# Altium project Discharge.PrjPcb
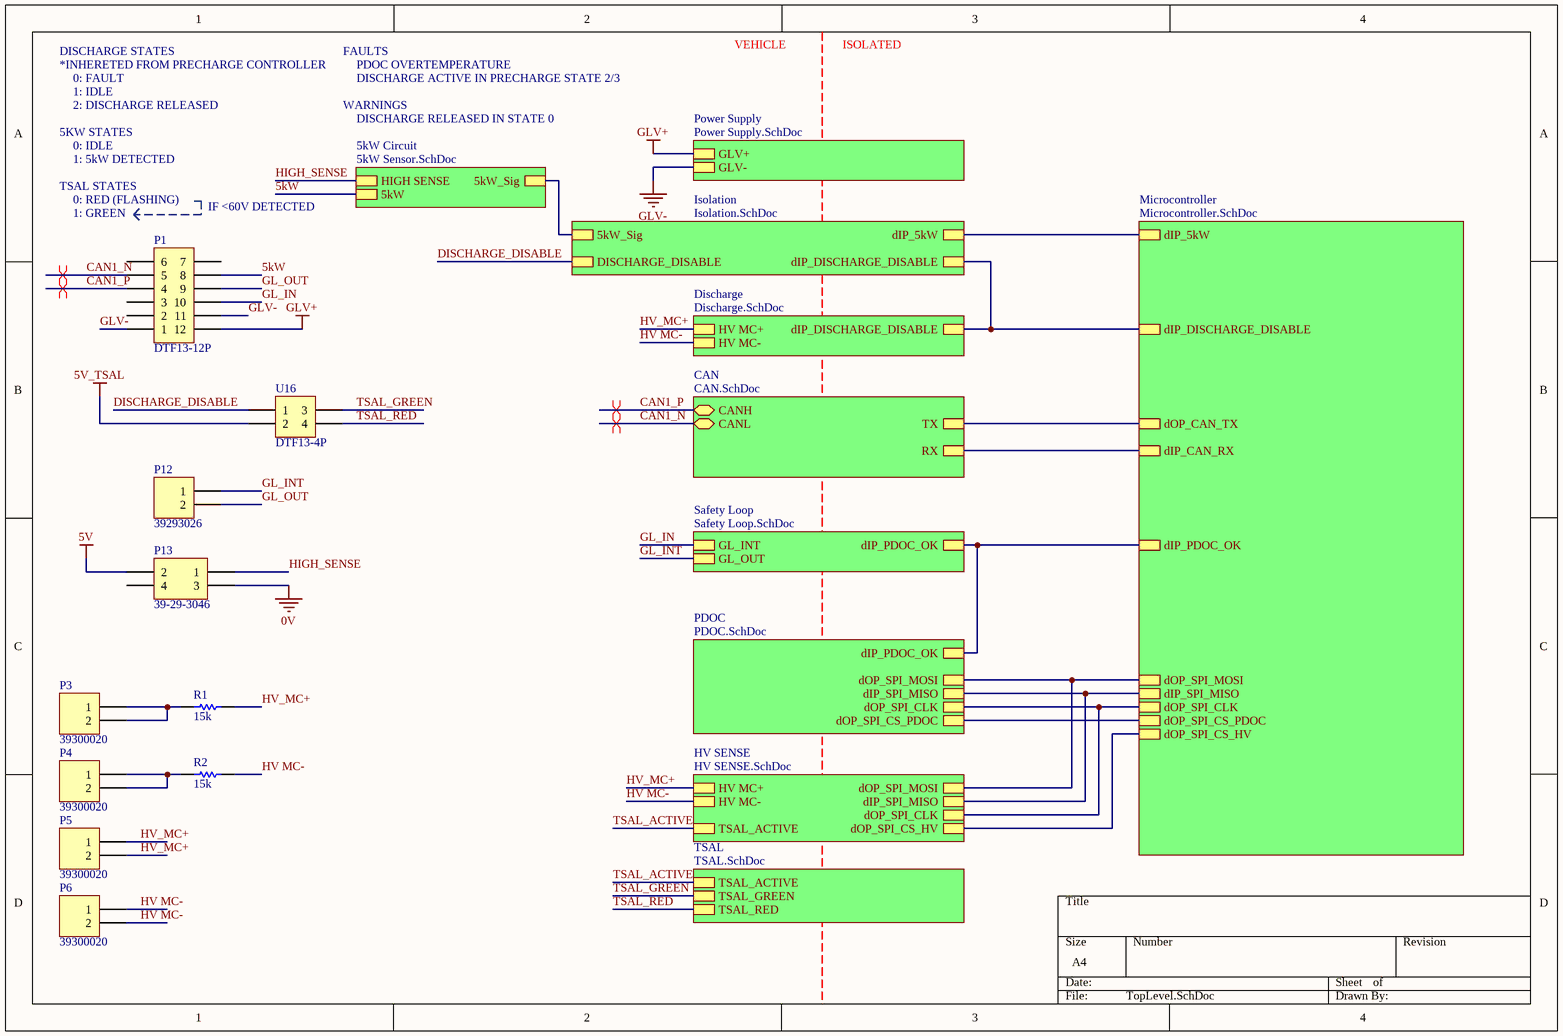
[diagram p0: TopLevel.SchDoc]
10 sheets, 177 parts. Net scope: hierarchical (ports join the sheet entries above them; power ports are global).
Board files: Discharge_B2.PcbDoc, Discharge_B3.PcbDoc, Discharge_B5.PcbDoc, Discharge_B4.PcbDoc, Discharge_C1.PcbDoc, Discharge_C2.PcbDoc
Sheets:
  TopLevel.SchDoc
    Power Supply = Power Supply.SchDoc
    Isolation = Isolation.SchDoc
    Safety Loop = Safety Loop.SchDoc
    Discharge = Discharge.SchDoc
    PDOC = PDOC.SchDoc
    HV SENSE = HV Sense.SchDoc
    Microcontroller = Microcontroller.SchDoc
    5kW Circuit = 5kW Sensor.SchDoc
    TSAL = TSAL.SchDoc

## Sheet TopLevel.SchDoc
size A4; SheetNumber: 1; SheetTotal: 11

### Parts
P1  DTF13-12P  [DTF13-12P]
P3  39300020  [39300020]
P4  39300020  [39300020]
P5  39300020  [39300020]
P6  39300020  [39300020]
P12  39293026  [39293026]
P13  39-29-3046  [39-29-3046-Footprint-1]
R1  15k  [TE_SMF7]
R2  15k  [TE_SMF7]
U16  DTF13-4P  [DTF13-4P]

### Sub-sheets
5kW Circuit = 5kW Sensor.SchDoc: 5kW_Sig, HIGH SENSE, 5kW
CAN = CAN.SchDoc (file not in this document): CANH (bidir), CANL (bidir), TX, RX
Discharge = Discharge.SchDoc: dIP_DISCHARGE_DISABLE, HV MC+, HV MC-
HV SENSE = HV SENSE.SchDoc: HV MC+, HV MC-, dOP_SPI_MOSI, dIP_SPI_MISO, dOP_SPI_CLK, dOP_SPI_CS_HV, TSAL_ACTIVE
Isolation = Isolation.SchDoc: dIP_DISCHARGE_DISABLE, DISCHARGE_DISABLE, 5kW_Sig, dIP_5kW
Microcontroller = Microcontroller.SchDoc: dIP_PDOC_OK, dIP_DISCHARGE_DISABLE, dIP_5kW, dOP_CAN_TX, dIP_CAN_RX, dOP_SPI_MOSI, dIP_SPI_MISO, dOP_SPI_CLK, dOP_SPI_CS_PDOC, dOP_SPI_CS_HV
PDOC = PDOC.SchDoc: dIP_PDOC_OK, dOP_SPI_CLK, dOP_SPI_MOSI, dIP_SPI_MISO, dOP_SPI_CS_PDOC
Power Supply = Power Supply.SchDoc: GLV+, GLV-
Safety Loop = Safety Loop.SchDoc: GL_INT, GL_OUT, dIP_PDOC_OK
TSAL = TSAL.SchDoc: TSAL_GREEN, TSAL_RED, TSAL_ACTIVE

### Nets
0V: P13.3
5V: P13.2
5V_TSAL: U16.2
GLV+: P1.12 ; sheet Power Supply/GLV+
GLV-: P1.1 P1.11 ; sheet Power Supply/GLV-
HV MC-: P6.1 P6.2 R2.2 ; sheet Discharge/HV MC-, sheet HV SENSE/HV MC-
5kW: P1.8 ; sheet 5kW Circuit/5kW
5kW_Sig: sheet Isolation/5kW_Sig, sheet 5kW Circuit/5kW_Sig
CAN1_N: P1.5 ; sheet CAN/CANL
CAN1_P: P1.4 ; sheet CAN/CANH
DISCHARGE_DISABLE: U16.1 ; sheet Isolation/DISCHARGE_DISABLE
GL_IN: P1.10 ; sheet Safety Loop/GL_INT
GL_INT: P12.1 ; sheet Safety Loop/GL_OUT
GL_OUT: P1.9 P12.2
HIGH_SENSE: P13.1 ; sheet 5kW Circuit/HIGH SENSE
HV_MC+: P5.1 P5.2 R1.2 ; sheet Discharge/HV MC+, sheet HV SENSE/HV MC+  [project net HV MC +]
TSAL_ACTIVE: sheet HV SENSE/TSAL_ACTIVE, sheet TSAL/TSAL_ACTIVE
TSAL_GREEN: U16.3 ; sheet TSAL/TSAL_GREEN
TSAL_RED: U16.4 ; sheet TSAL/TSAL_RED
NetD12_K: sheet PDOC/dIP_SPI_MISO, sheet HV SENSE/dIP_SPI_MISO, sheet Microcontroller/dIP_SPI_MISO
NetP3_1: P3.1 P3.2 R1.1
NetP4_1: P4.1 P4.2 R2.1
NetR11_1: sheet Isolation/dIP_DISCHARGE_DISABLE, sheet Discharge/dIP_DISCHARGE_DISABLE, sheet Microcontroller/dIP_DISCHARGE_DISABLE
NetR19_1: sheet Microcontroller/dOP_CAN_TX, sheet CAN/TX
NetR20_1: sheet Microcontroller/dIP_CAN_RX, sheet CAN/RX
NetR22_1: sheet HV SENSE/dOP_SPI_CS_HV, sheet Microcontroller/dOP_SPI_CS_HV
NetR23_1: sheet PDOC/dOP_SPI_CS_PDOC, sheet Microcontroller/dOP_SPI_CS_PDOC
NetU8_13: sheet Isolation/dIP_5kW, sheet Microcontroller/dIP_5kW
NetU8_26: sheet Safety Loop/dIP_PDOC_OK, sheet PDOC/dIP_PDOC_OK, sheet Microcontroller/dIP_PDOC_OK
NetU8_27: sheet PDOC/dOP_SPI_CLK, sheet HV SENSE/dOP_SPI_CLK, sheet Microcontroller/dOP_SPI_CLK
NetU8_29: sheet PDOC/dOP_SPI_MOSI, sheet HV SENSE/dOP_SPI_MOSI, sheet Microcontroller/dOP_SPI_MOSI

Not connected (* = marked no-connect by the designer): P1 2 3 6 7; P13 4

### Layout directives
differential pair: CAN1_N, CAN1_P

### Notes on the sheet
- DISCHARGE STATES
- *INHERETED FROM PRECHARGE CONTROLLER
- 0: FAULT
- 1: IDLE
- 2: DISCHARGE RELEASED
- FAULTS
- WARNINGS
- PDOC OVERTEMPERATURE
- DISCHARGE ACTIVE IN PRECHARGE STATE 2/3
- VEHICLE
- ISOLATED
- 5KW STATES
- 1: 5kW DETECTED
- 0: IDLE
- DISCHARGE RELEASED IN STATE 0
- TSAL STATES
- 0: RED (FLASHING)
- (near P1) 1: GREEN
- (near P1) IF <60V DETECTED

### Library data of the parts
P1 = DTF13-12P: Positions: 12; Pitch: 4.45mm; Angle: 90; Flange: No; Contact: Copper Alloy; Part Number: DTF13-12P; Row Spacing: 4.45mm; Digikey Part Number: 1734-1861-ND; Digikey Link: https://www.digikey.com/products/en?keywords=dtf13-12pa
P3-P6 = 39300020: Pitch: 4.2mm; Row Spacing: 5.5mm; Angle: 90; Flange: No; Contact: Tin; Part Number: 39300020; Positions: 2; Digikey Part Number: WM21351-ND
P12 = 39293026: Pitch: 4.2mm; Row Spacing: 5.5mm; Angle: 0; Flange: No; Contact: Tin; Part Number: 39293026; Positions: 2; Digikey Part Number: WM3843-ND
P13 = CMP-104-000011-1: Rectangular Power Connector, 4 Contact(s), Male, Solder Terminal, Plug; Mating Information: MULTIPLE MATING PARTS AVAILABLE; Durability: 30Cycles; Mixed Contacts: No; Body Length: 0.38inch; Number Of PCB Rows: 2; Contact Style: SQ PIN-SKT; Mounting Option 1: POLARIZED LCK; Connector Type: Power,Rectangular; Body Breadth: 0.378inch; Number of Contacts: 4; Mating Contact Pitch: 0.165inch; Insertion Force-Max: 6.672N; Insulation Resistance: 1GR; Mounting Option 2: LOCKING; Rated Current (Signal): 8A; Dielectric Withstanding Voltage (AC): 1.5kV; Polarization Key: POLARIZED HOUSING; Body Depth: 0.504inch; Withdrawl Force-Min: 3.1136N; Number Of Connectors: 1; Option: General Purpose; Contact Resistance: 10mR; Plating Thickness: 35uin; PCB Contact Row Spacing: 5.5118mm; Reliability: COMMERCIAL; Reference Standard: UL; Max Operating Temperature: 105°C; Body/Shell Style: PLUG; Contact Finish - Mating: NOT SPECIFIED; Reach SVHC Compliant: Yes; Contact Gender: Male; PCB Contact Pattern: RECTANGULAR; DIN Conformance: No; Min Operating Temperature: -40°C; Contact Pattern: RECTANGULAR; MIL Conformance: No; Shell Material: POLYAMIDE66; IEC Conformance: No; Filter Feature: No; Flammability Rating: UL94 V-2; RoHS Compliant: Yes; Terminal Pitch: 4.191mm; Mounting Technology: Board; Number of Rows Loaded: 2; Empty Shell: No; Insulation Material: Nylon; Termination: Solder; Terminal Length: 0.138inch; Mounting Style: STRAIGHT; Mating Contact Row Spacing: 0.165inch
R1 R2 = SMF715KJ: Manufacturer: TE; Tolerance: 0.05; Rated Power: 7W; Part Number: SMF715KJ; Value: 15k; Material: Metal Film
U16 = DTF13-4P: Positions: 4; Pitch: 9.12mm; Row Spacing: 4.45mm; Angle: 90; Flange: Yes; Contact: Copper Alloy; Part Number: DTF13-4P; Digikey Part Number: 1734-1646-ND; Digikey Link: https://www.digikey.com.au/products/en?keywords=dtf13-4p

## Sheet Power Supply.SchDoc
size A4; SheetNumber: 3; SheetTotal: 11
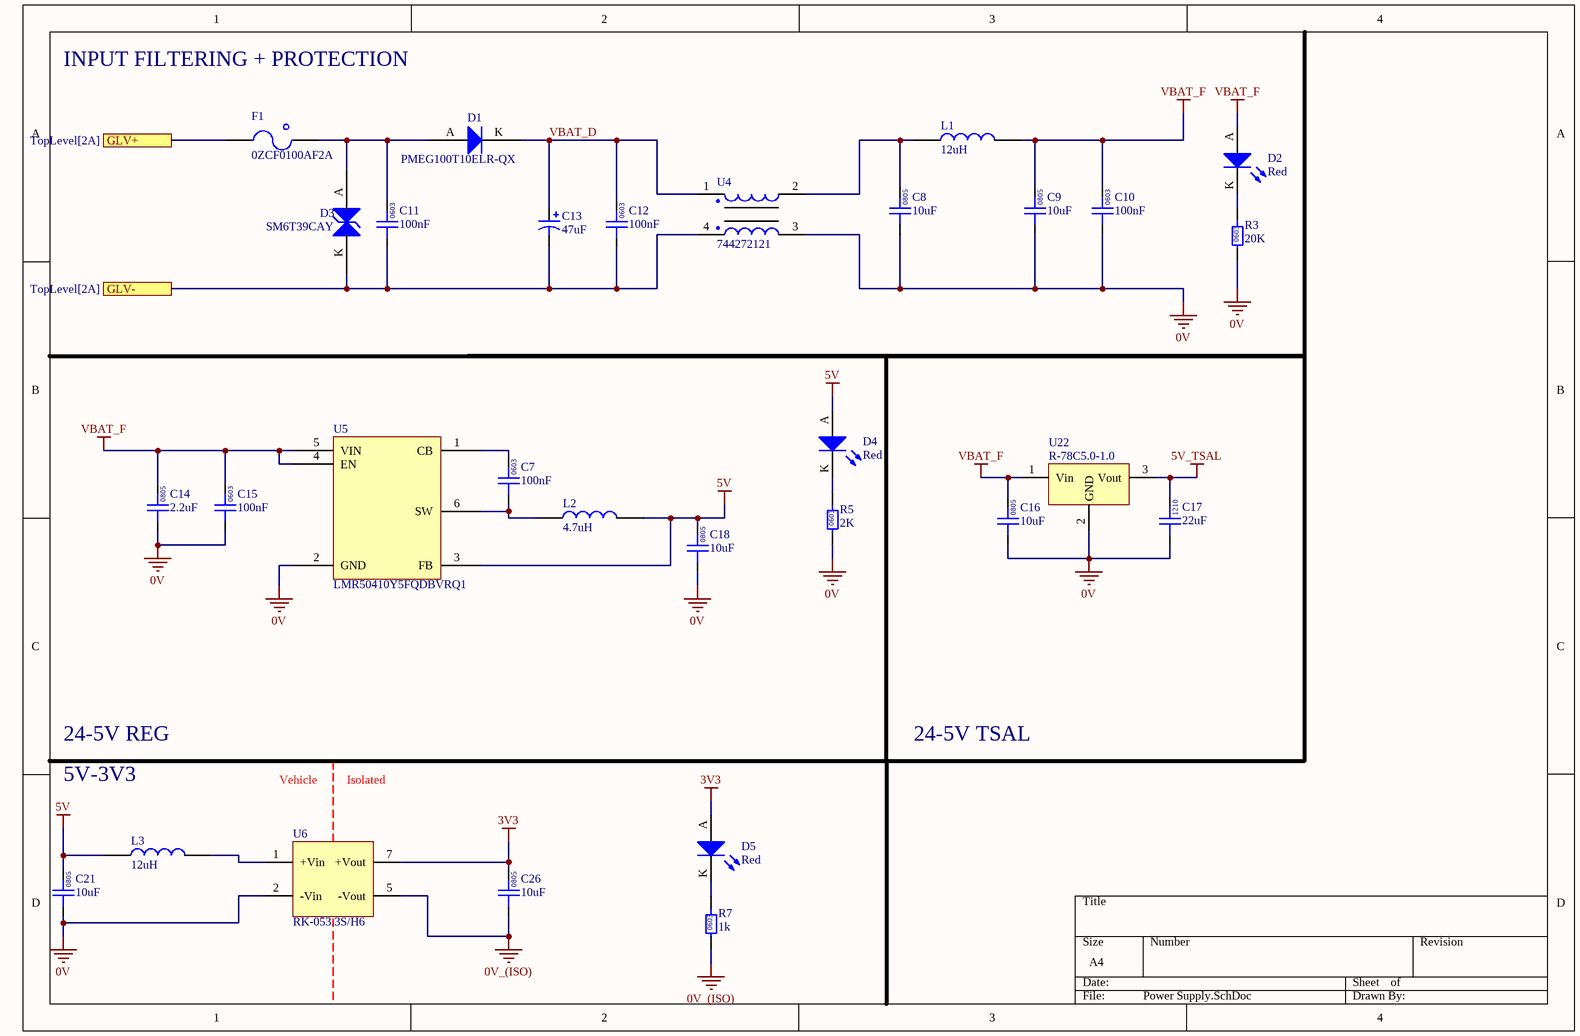
[diagram p1: Power Supply.SchDoc]

### Parts
C7  100nF  [0603]
C8  10uF  [0805]
C9  10uF  [0805]
C10  100nF  [0603]
C11  100nF  [0603]
C12  100nF  [0603]
C13  47uF  [CHEMI-CON ELCO]
C14  2.2uF  [0805]
C15  100nF  [0603]
C16  10uF  [0805]
C17  22uF  [1210]
C18  10uF  [0805]
C21  10uF  [0805]
C26  10uF  [0805]
D1  PMEG100T10ELR-QX  [SODFL350X110-2N]
D2  Red  [0805 LED]
D3  SM6T39CAY  [SM6T39CAY-Footprint-1]
D4  Red  [0805 LED]
D5  Red  [0805 LED]
F1  0ZCF0100AF2A  [2920]
L1  12uH  [1812]
L2  4.7uH  [SRN3015TA-4R7M]
L3  12uH  [1812]
R3  20K  [0603]
R5  2K  [0603]
R7  1k  [0603]
U4  744272121  [Wurth 4-PC Pad]
U5  LMR50410Y5FQDBVRQ1  [TI-SOT23-6]
U6  RK-053.3S/H6  [RK-053.3S/H6]
U22  R-78C5.0-1.0  [RECOM 3-SIP]

### Ports
GLV+ (see TopLevel[2A]), GLV- (see TopLevel[2A])

### Nets
0V: C8.1 C9.1 C10.1 C14.1 C15.1 C16.1 C17.1 C18.1 C21.1 R3.1 R5.1 U4.3 U5.2(GND) U6.2(-Vin) U22.2(GND)
0V_(ISO): C26.1 R7.1 U6.5(-Vout)
3V3: C26.2 D5.A U6.7(+Vout)
5V: C18.2 C21.2 D4.A L2.1 L3.2 U5.3(FB)
5V_TSAL: C17.2 U22.3(Vout)
GLV+: F1.1 ; port GLV+
GLV-: C11.1 C12.1 C13.1 D3.K U4.4 ; port GLV-
VBAT_F: C9.2 C10.2 C14.2 C15.2 C16.2 D2.A L1.1 U5.4(EN) U5.5(VIN) U22.1(Vin)
VBAT_D: C12.2 C13.2 D1.K U4.1
NetC7_1: C7.1 L2.2 U5.6(SW)
NetC7_2: C7.2 U5.1(CB)
NetC8_2: C8.2 L1.2 U4.2
NetC11_2: C11.2 D1.A D3.A F1.2
NetD2_K: D2.K R3.2
NetD4_K: D4.K R5.2
NetD5_K: D5.K R7.2
NetL3_1: L3.1 U6.1(+Vin)

### Notes on the sheet
- INPUT FILTERING + PROTECTION
- 5V-3V3
- 24-5V REG
- Vehicle
- Isolated
- 24-5V TSAL
- (in symbol GCM188L81H104KA57D) 0603
- (in symbol GRM21BR6YA106KE43L) 0805
- (in symbol GRM21BR61A226ME51L) 0805
- (in symbol GRM32ER71E226KE15L) 1210
- (in symbol RC0603FR-071KL) 0603
- (in symbol RC0603FR-072KL) 0603
- (in symbol RC0603FR-0720KL) 0603

### Library data of the parts
C7 C10-C12 C15 = GCM188L81H104KA57D: Manufacturer: muRata; Rated Voltage: 50V; Tolerance: ±10%; Material: MLCC; Temperature Rating: X8L; Part Number: GCM188L81H104KA57D; Value: 100nF; Digikey Part Number: 490-6049-1-ND
C8 C9 C16 C18 C21 C26 = GRM21BR6YA106KE43L: Manufacturer: muRata; Rated Voltage: 50V; Tolerance: 10%; Material: MLCC; Temperature Rating: X5R; Part Number: GRM21BR6YA106KE43L; Value: 10uF; Digikey Part Number: 490-10514-6-ND
C13 = HHXA350ARA470MF61G: Part Number: HHXA350ARA470MF61G
C14 = GRM21BR61A226ME51L: Manufacturer: muRata; Value: 22uF; Rated Voltage: 50V; Tolerance: 20%; Material: MLCC; Temperature Rating: X5R; Part Number: GRM21BR61A226ME51L; Digikey Part Number: 490-10511-1-ND
C17 = GRM32ER71E226KE15L: Manufacturer: Murata Electronics; Rated Voltage: 25V; Tolerance: ±10%; Material: MLCC; Temperature Rating: X7R; Part Number: GRM32ER71E226KE15L; Value: 22uF; Digikey Part Number: 490-5313-2-ND
D1 = CMP-004-00005-4: Diode 100 V 1A Surface Mount SOD-123W
D2 D4 D5 = SML-210LTT86: Red LED Indication - Discrete 1.75V 0805 (2012 Metric); Manufacturer: ROHM Semiconductor; Part Number: SML-210LTT86; Colour: Red; Digikey Part Number: 511-1286-1-ND
D3 = CMP-004-00003-4: TVS Diode Single Bi-Dir 33.3V 600W Automotive 2-Pin SMB T/R / TVS DIODE 33.3VWM 69.7VC SMB; Peak Pulse Current: 57A; Polarity: Bidirectional; Min Breakdown Voltage: 37.1V; Test Current: 1mA; Number of Elements: 1; Operating Supply Voltage: 30V; Diode Type: ZENER; Clamping Voltage: 53.9V; Leakage Current: 200nA; Power Line Protection: No; Max Surge Current: 11.1A; Max Breakdown Voltage: 41V; Breakdown Voltage: 39V; Max Power Dissipation: 600W; Radiation Hardening: No; Resistor Type: Zener; Termination: SMD/SMT; REACH SVHC: No SVHC; Reverse Breakdown Voltage: 37.1V; Max Operating Temperature: 150°C; Min Operating Temperature: -55°C; Element Configuration: Single; Length: 4.6mm; Case/Package: DO-214AA; Reverse Standoff Voltage: 33.3V; Number of Bidirectional Channels: 1; Number of Pins: 2; Direction: Bidirectional; Mount: Surface Mount; Package Quantity: 1; Width: 3.95mm; RoHS Compliant: Yes; Number of Channels: 1; Packaging: Tape and Reel; Max Reverse Leakage Current: 200nA; Peak Pulse Power: 600W; Height: 2.45mm; Series: Automotive, AEC-Q101, SM6TY, TRANSIL™
F1 = 0ZCF0100AF2A: PTC RESET FUSE 60V 1A 292; Manufacturer: Littelfuse Inc.; Part Number: 0ZCF0100AF2A; Digikey Part Number: 507-2070-1-ND; Digikey Link: https://www.digikey.com/product-detail/en/bel-fuse-inc/0ZCF0100AF2A/507-2070-1-ND/6210547
L1 L3 = RLS-126: Manufacturer: Recom; Tolerance: 0.2; Impedance: 230mOhm; Rated Current: 0.8 A; Material: Wirewound; Part Number: RLS-126; Value: 12uH; Digikey Part Number: 945-3429-ND
L2 = SRN4018-4R7M: Manufacturer: Bourns; Tolerance: 0.2; Impedance: 84mOhms; Rated Current: 1.9A; Material: Wirewound; Part Number: SRN4018-4R7M; Value: 4.7uH; Digikey Part Number: SRN3015TA-4R7MCT-ND
R3 = RC0603FR-0720KL: Manufacturer: YAGEO; Tolerance: 0.01; Rated Power: 0.1W; Part Number: RC0603FR-0720KL; Value: 20K; Digikey Part Number: 311-20.0KHRCT-ND; Material: FR-07
R5 = RC0603FR-072KL: Manufacturer: YAGEO; Tolerance: 0.01; Rated Power: 0.1W; Part Number: RC0603FR-072KL; Value: 2K; Digikey Part Number: 311-2.00KHRCT-ND; Material: FR-07
R7 = RC0603FR-071KL: Manufacturer: YAGEO; Tolerance: 0.01; Rated Power: 0.1W; Part Number: RC0603FR-071KL; Value: 1k; Digikey Part Number: 311-1.00KHRCT-ND; Material: FR-07
U4 = 744272121: Manufacturer: Wurth Electronics Inc; Value: 120uH @ 100kHz; Impedance: 460 Ohms @ 30MHz; Rated Current: 2.5 A; Part Number: 744272121; Material: Wirewound; Digikey Part Number: 732-1489-1-ND
U5 = LMR50410-Q1: IC REG BUCK 5V 1A SOT23-6; Manufacturer: Texas Instruments; Input Voltage: 4-36V; Part Number: LMR50410-Q1; Output Voltage: 5V; Output Current: 1A; Digikey Part Number: 296-LMR50410Y5FQDBVRQ1CT-ND
U6 = RK-053.3S/H6: DC DC CONVERTER 3.3V 1W; Manufacturer: Recom; Input Voltage: 5V; Output Current: 303mA; Part Number: RK-053.3S/H6; Output Voltage: 3.3V
U22 = R-78C5.0-1.0: CONV DC/DC 1A 5V OUT SIP VERT; Manufacturer: Recom; Output Power: 5W; Isolation: Non-Isolated; Part Number: R-78C5.0-1.0; Output Voltage: 5V; Digikey Part Number: 945-1395-5-ND; Digikey Link: https://www.digikey.com.au/product-detail/en/recom-power/R-78C5.0-1.0/945-1395-5-ND/2652148

## Sheet Isolation.SchDoc
size A4; SheetNumber: 10; SheetTotal: 11
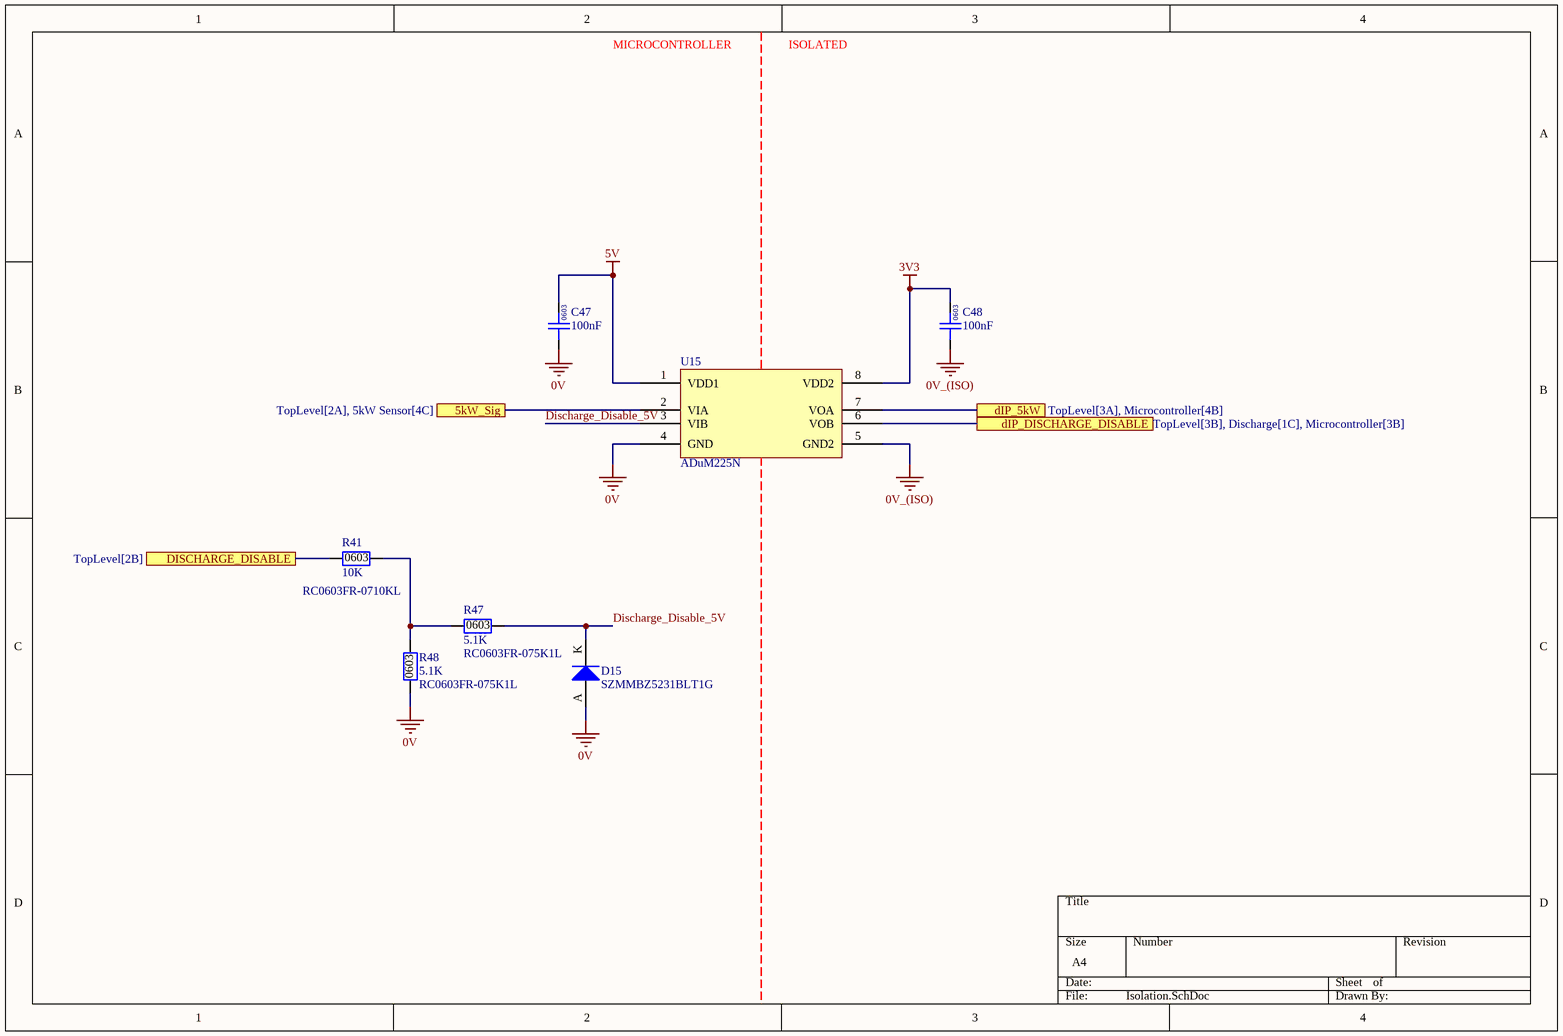
[diagram p2: Isolation.SchDoc]

### Parts
C47  100nF  [0603]
C48  100nF  [0603]
D15  SZMMBZ5231BLT1G  [SOT23-3]
R41  RC0603FR-0710KL  value 10K  [RESC0603]
R47  RC0603FR-075K1L  value 5.1K  [RESC0603]
R48  RC0603FR-075K1L  value 5.1K  [RESC0603]
U15  ADuM225N  [AD-SOIC-8W]

### Ports
5kW_Sig (see TopLevel[2A], 5kW Sensor[4C]), dIP_5kW (see TopLevel[3A], Microcontroller[4B]), dIP_DISCHARGE_DISABLE (see TopLevel[3B], Discharge[1C], Microcontroller[3B]), DISCHARGE_DISABLE (see TopLevel[2B])

### Nets
0V: C47.1 D15.A R48.1 U15.4(GND)
0V_(ISO): C48.1 U15.5(GND2)
3V3: C48.2 U15.8(VDD2)
5V: C47.2 U15.1(VDD1)
5kW_Sig: U15.2(VIA) ; port 5kW_Sig
DISCHARGE_DISABLE: R41.1 ; port DISCHARGE_DISABLE
Discharge_Disable_5V: D15.K R47.2 U15.3(VIB)
NetR11_1: U15.6(VOB) ; port dIP_DISCHARGE_DISABLE
NetR41_2: R41.2 R47.1 R48.2
NetU8_13: U15.7(VOA) ; port dIP_5kW

### Notes on the sheet
- MICROCONTROLLER
- ISOLATED
- (in symbol GCM188L81H104KA57D) 0603

### Library data of the parts
C47 C48 = GCM188L81H104KA57D: as C7 on sheet Power Supply; Part Number: GCM188L81H104KA57D; Value: 100nF; Digikey Part Number: 490-6049-1-ND
D15 = CMP-107-000002-2: Zener Diode, 5.1V V(Z), 5.1%, 0.225W, Silicon, Unidirectional, TO-236AB; Part Number: BAS21; Package Body Material: Plastic; Dynamic Impedance-Max: 17R; Number of Elements: 1; Max Power Dissipation: 225mW; Test Current: 20mA; Reference Standard: AEC-Q101; Digikey Link: #https://www.digikey.com.au/en/products/detail/smc-diode-solutions/BAS21/6022500#; JEDEC-95 Code: TO-236AB; Diode Type: ZENER; Package Shape: Rectangular; Reach SVHC Compliant: Yes; JESD-30 Code: R-PDSO-G3; Package Style: SMALL OUTLINEMeter; Technology: ZENER; Surface Mount: Yes; RoHS Compliant: Yes; Reference Voltage-Nom: 5.1V; JESD-609 Code: e3; Moisture Sensitivity Level: 1; Terminal Finish: Tin; Diode Element Material: SILICON; Voltage Tol-Max: 5.1%; Pins: 3; Min Operating Temperature: -65°C; Polarity: Unidirectional; Terminal Position: DUAL; Terminal Form: Gull Wing; Max Operating Temperature: 150°C
R41 = CMP-RES-0102-2: RES SMD 10K OHM JUMPER 1/10W 0603; Tolerance: 1%; Power Rating: 100mW; Voltage Rating: 50V; Min Operating Temperature: -55°C; Case/Package: 0603; Max Operating Temperature: 155°C
R47 R48 = CMP-RES-0095-2: RES SMD 5.1K OHM JUMPER 1/10W 0603; Tolerance: 1%; Power Rating: 100mW; Voltage Rating: 50V; Case/Package: 0603; Max Operating Temperature: 155°C; Min Operating Temperature: -55°C
U15 = ADuM225N: DIGITAL ISOLATOR, DUAL CHANNEL; Manufacturer: Analogue Devices; Part Number: ADuM225N

## Sheet Safety Loop.SchDoc
size A4; SheetNumber: 4; SheetTotal: 11
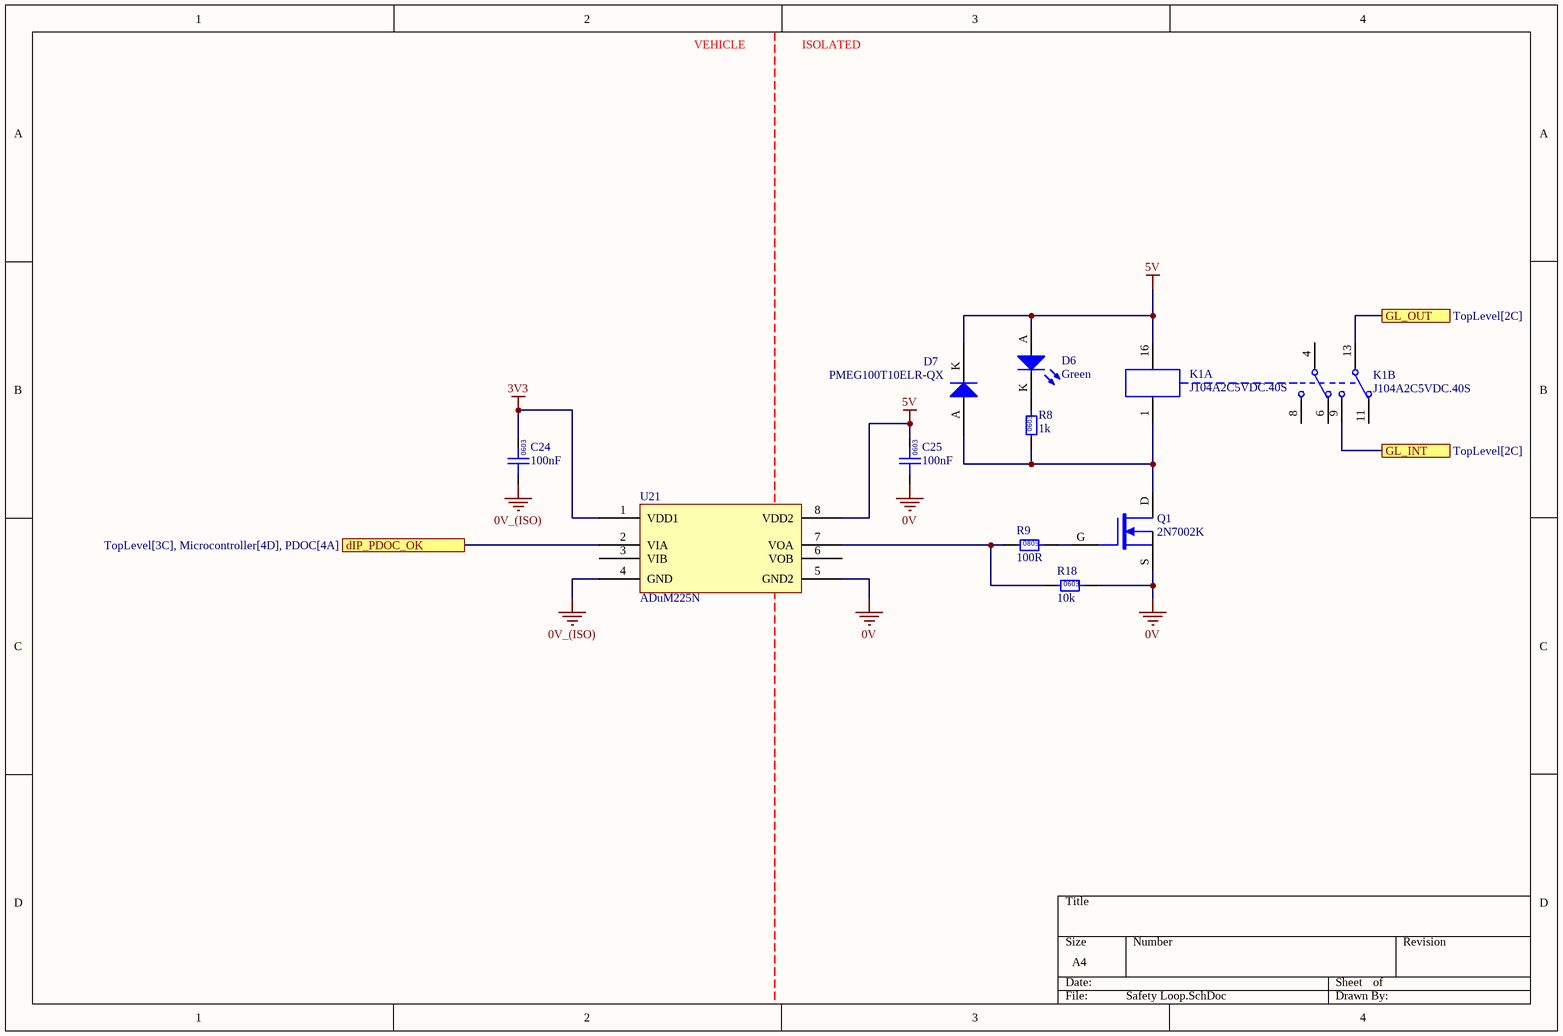
[diagram p3: Safety Loop.SchDoc]

### Parts
C24  100nF  [0603]
C25  100nF  [0603]
D6  Green  [0805 LED]
D7  PMEG100T10ELR-QX  [SODFL350X110-2N]
K1  J104A2C5VDC.40S  [J104A2C5VDC.40S-Footprint-1]  (parts A,B of 2)
Q1  2N7002K  [2N7002K-Footprint-1]
R8  1k  [0603]
R9  100R  [0805]
R18  10k  [0603]
U21  ADuM225N  [AD-SOIC-8W]

### Ports
dIP_PDOC_OK (see TopLevel[3C], Microcontroller[4D], PDOC[4A]), GL_INT (see TopLevel[2C]), GL_OUT (see TopLevel[2C])

### Nets
0V: C25.1 Q1.S R18.2 U21.5(GND2)
0V_(ISO): C24.1 U21.4(GND)
3V3: C24.2 U21.1(VDD1)
5V: C25.2 D6.A D7.K K1.16 U21.8(VDD2)
GL_IN: K1.9 ; port GL_INT
GL_INT: K1.13 ; port GL_OUT
NetD6_K: D6.K R8.2
NetD7_A: D7.A K1.1 Q1.D R8.1
NetQ1_G: Q1.G R9.2
NetR9_1: R9.1 R18.1 U21.7(VOA)
NetU8_26: U21.2(VIA) ; port dIP_PDOC_OK

Not connected (* = marked no-connect by the designer): K1 4 6 8 11; U21 3(VIB) 6(VOB)

### Notes on the sheet
- VEHICLE
- ISOLATED
- (in symbol GCM188L81H104KA57D) 0603
- (in symbol RC0603FR-071KL) 0603
- (in symbol RC0603FR-0710KL) 0603
- (in symbol RC0805FR07100RL) 0805

### Library data of the parts
C24 C25 = GCM188L81H104KA57D: as C7 on sheet Power Supply; Part Number: GCM188L81H104KA57D; Value: 100nF; Digikey Part Number: 490-6049-1-ND
D6 = SML-210FTT86: Green LED Indication - Discrete 1.75V 0805 (2012 Metric); Manufacturer: ROHM Semiconductor; Part Number: SML-210FTT86; Colour: Green; Digikey Part Number: 511-1285-1-ND
D7 = CMP-004-00005-4: Diode 100 V 1A Surface Mount SOD-123W
K1 = CMP-008-00001-1: Relay Gen Purpose DPDT 3A 5V
Q1 = CMP-038-000000-2: 60V 380mA, NFET MOSTFET (Small Signal); Part Number: 2N7002K
R8 = RC0603FR-071KL: as R7 on sheet Power Supply; Part Number: RC0603FR-071KL; Value: 1k; Digikey Part Number: 311-1.00KHRCT-ND; Material: FR-07
R9 = RC0805FR07100RL: Manufacturer: YAGEO; Tolerance: 0.01; Rated Power: 0.125W; Part Number: RC0805FR07100RL; Value: 100R; Material: FR-07; Digikey Part Number: 311-100CRCT-ND
R18 = RC0603FR-0710KL: Manufacturer: YAGEO; Tolerance: 0.01; Rated Power: 0.1W; Part Number: RC0603FR-0710KL; Value: 10k; Material: FR-07; Digikey Part Number: 311-10.0KHRCT-ND
U21 = ADuM225N: as U15 on sheet Isolation; Part Number: ADuM225N

## Sheet Discharge.SchDoc
size A4; SheetNumber: 5; SheetTotal: 11
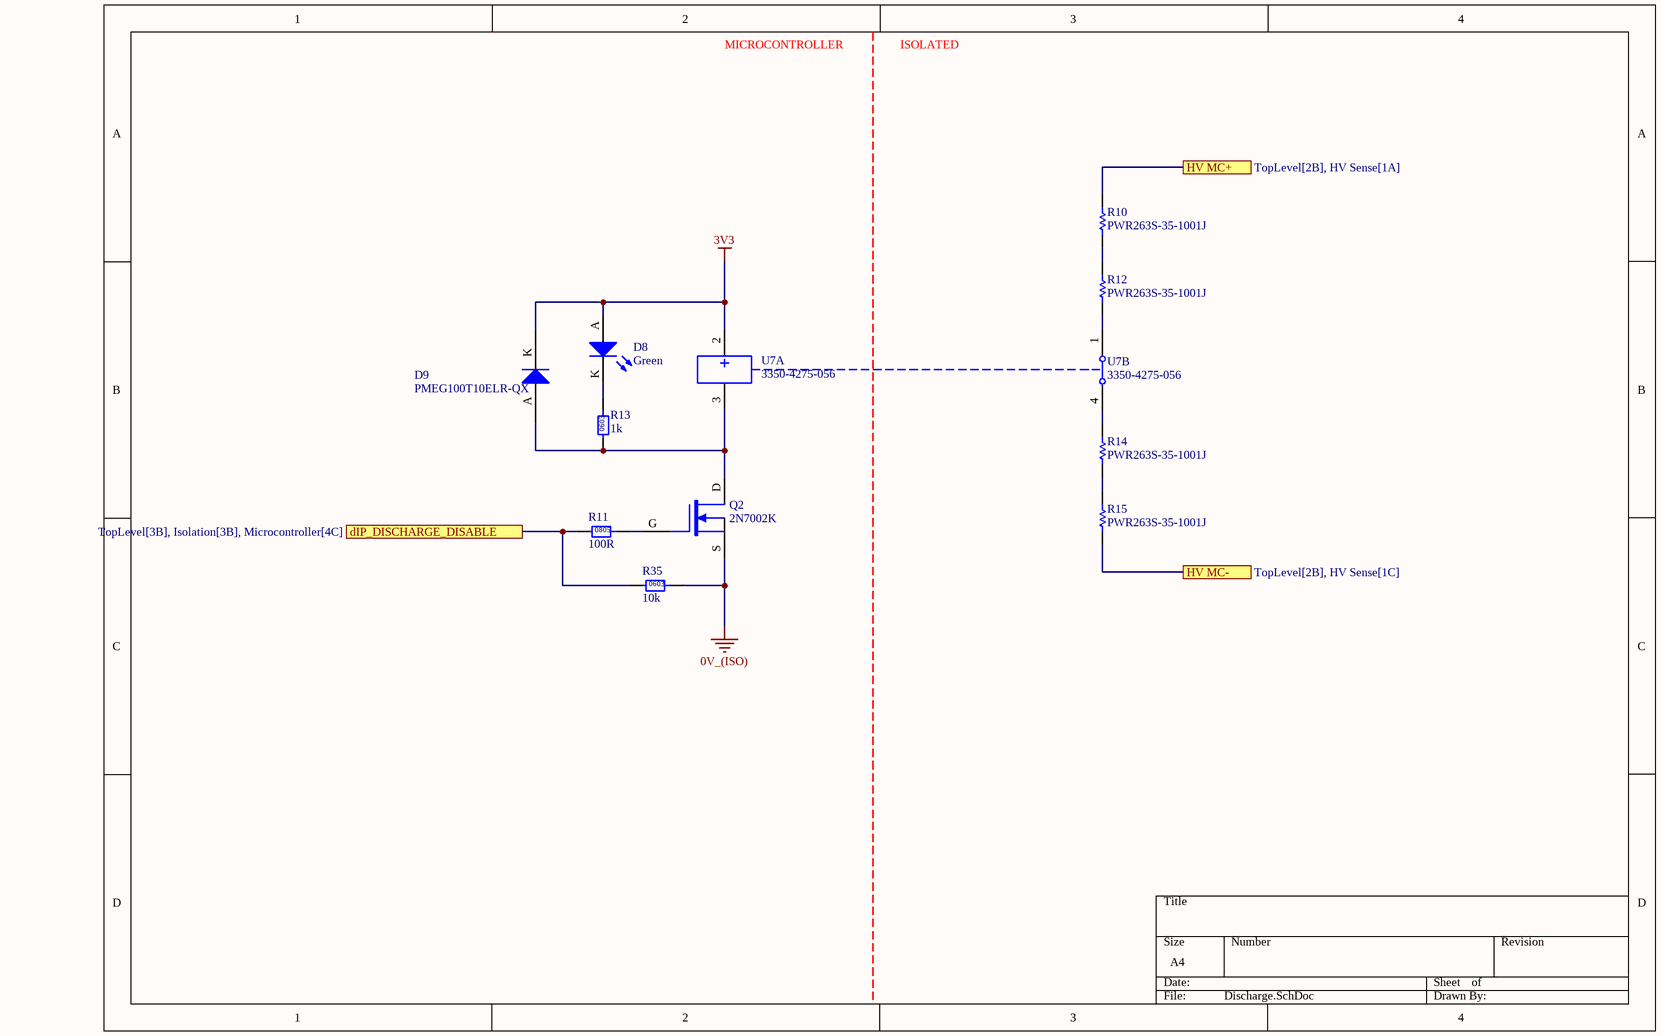
[diagram p4: Discharge.SchDoc]

### Parts
D8  Green  [0805 LED]
D9  PMEG100T10ELR-QX  [SODFL350X110-2N]
Q2  2N7002K  [2N7002K-Footprint-1]
R10  PWR263S-35-1001J  [B TO-263]
R11  100R  [0805]
R12  PWR263S-35-1001J  [B TO-263]
R13  1k  [0603]
R14  PWR263S-35-1001J  [B TO-263]
R15  PWR263S-35-1001J  [B TO-263]
R35  10k  [0603]
U7  3350-4275-056  [CI SPST]  (parts A,B of 2)

### Ports
dIP_DISCHARGE_DISABLE (see TopLevel[3B], Isolation[3B], Microcontroller[4C]), HV MC+ (see TopLevel[2B], HV Sense[1A]), HV MC- (see TopLevel[2B], HV Sense[1C])

### Nets
0V_(ISO): Q2.S R35.2
3V3: D8.A D9.K U7.2
HV MC-: R15.2 ; port HV MC-
HV MC +: R10.1 ; port HV MC+
NetD8_K: D8.K R13.2
NetD9_A: D9.A Q2.D R13.1 U7.3
NetQ2_G: Q2.G R11.2
NetR10_2: R10.2 R12.1
NetR11_1: R11.1 R35.1 ; port dIP_DISCHARGE_DISABLE
NetR12_2: R12.2 U7.1
NetR14_1: R14.1 U7.4
NetR14_2: R14.2 R15.1

### Notes on the sheet
- MICROCONTROLLER
- ISOLATED
- (in symbol RC0603FR-071KL) 0603
- (in symbol RC0603FR-0710KL) 0603
- (in symbol RC0805FR07100RL) 0805

### Library data of the parts
D8 = SML-210FTT86: as D6 on sheet Safety Loop; Part Number: SML-210FTT86; Colour: Green; Digikey Part Number: 511-1285-1-ND
D9 = CMP-004-00005-4: Diode 100 V 1A Surface Mount SOD-123W
Q2 = CMP-038-000000-2: 60V 380mA, NFET MOSTFET (Small Signal); Part Number: 2N7002K
R10 R12 R14 R15 = CMP-037-000402-1: Manufacturer: Bournes Inc; Value: 1k; Rated Voltage: 35W; Tolerance: 0.05; Part Number: PWR263S-35-1001J; Digikey Part Number: PWR263S-35-1001J-ND
R11 = RC0805FR07100RL: as R9 on sheet Safety Loop; Part Number: RC0805FR07100RL; Value: 100R; Material: FR-07; Digikey Part Number: 311-100CRCT-ND
R13 = RC0603FR-071KL: as R7 on sheet Power Supply; Part Number: RC0603FR-071KL; Value: 1k; Digikey Part Number: 311-1.00KHRCT-ND; Material: FR-07
R35 = RC0603FR-0710KL: as R18 on sheet Safety Loop; Part Number: RC0603FR-0710KL; Value: 10k; Material: FR-07; Digikey Part Number: 311-10.0KHRCT-ND
U7 = CMP-035-000005-1: RELAY REED HV SPST 200W 3A 5V (NC); Part Number: 3350-4275-056

## Sheet PDOC.SchDoc
size A4; SheetNumber: 8; SheetTotal: 11
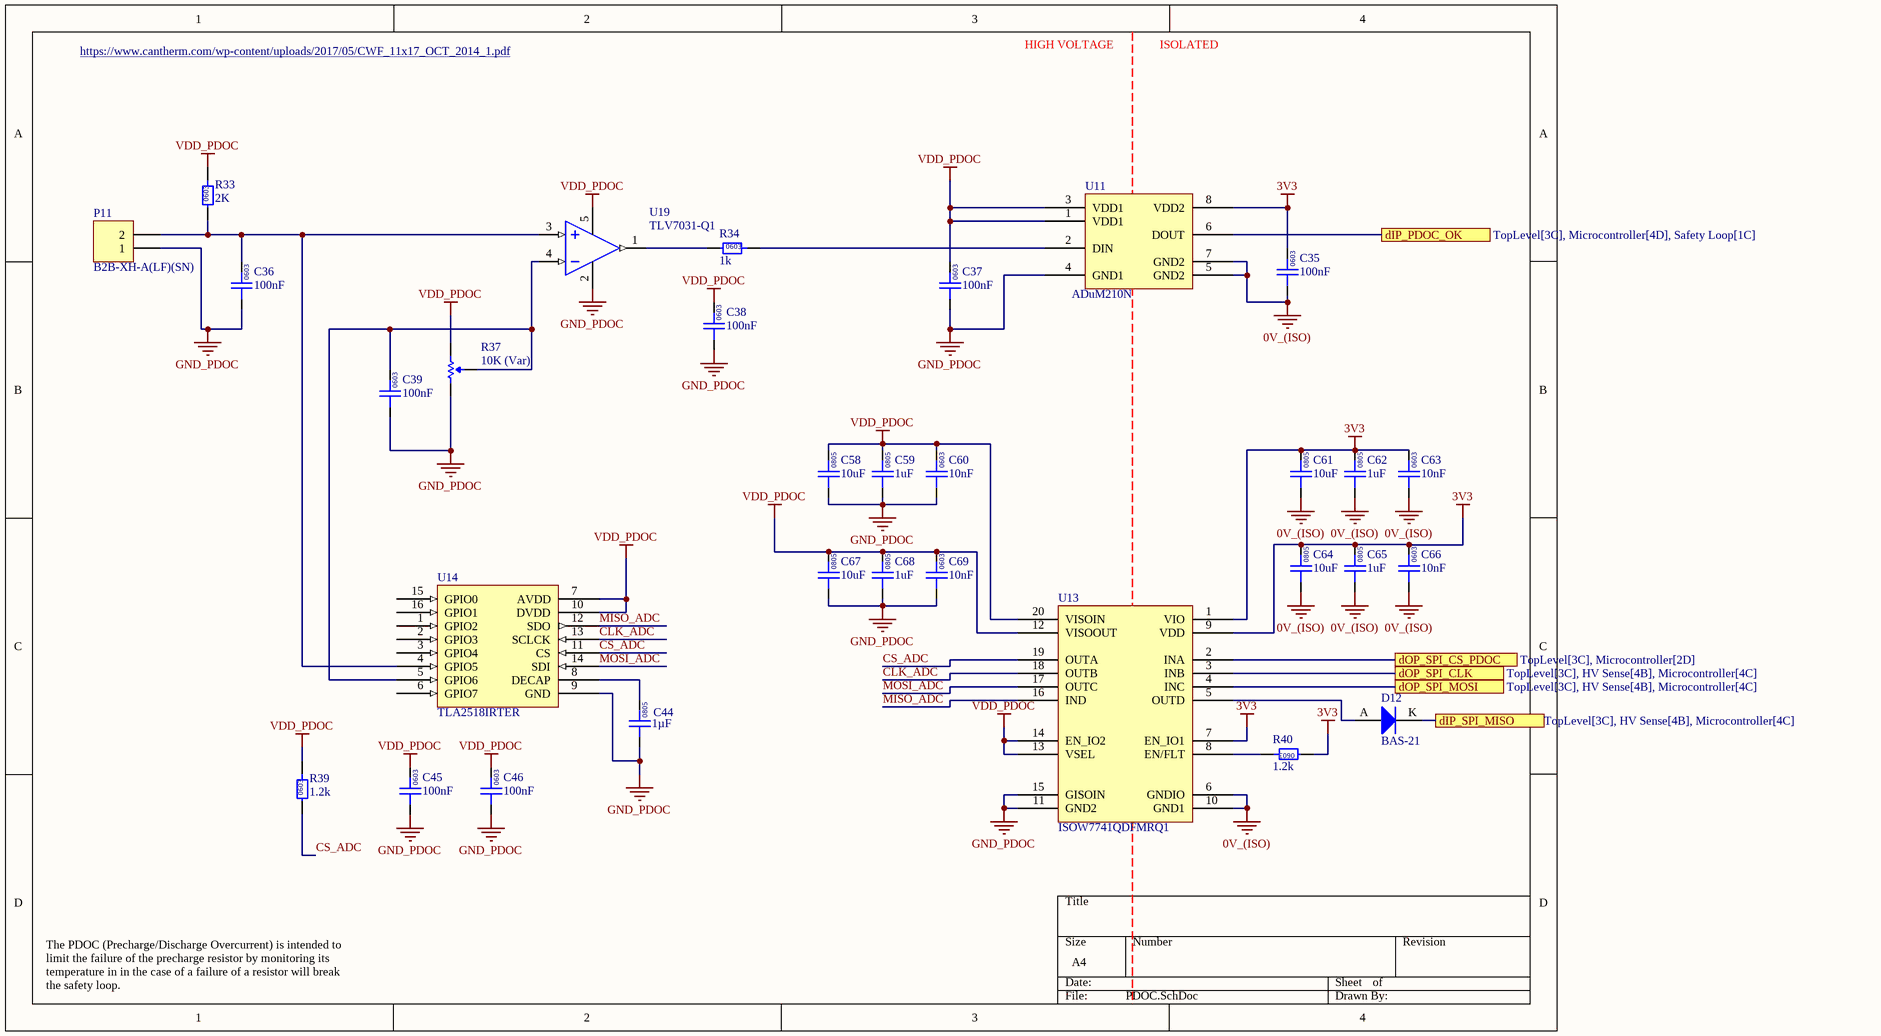
[diagram p5: PDOC.SchDoc]

### Parts
C35  100nF  [0603]
C36  100nF  [0603]
C37  100nF  [0603]
C38  100nF  [0603]
C39  100nF  [0603]
C44  1µF  [0805]
C45  100nF  [0603]
C46  100nF  [0603]
C58  10uF  [GCM21BR71H105KA03L-Footprint-1]
C59  1uF  [GCM21BR71H105KA03L-Footprint-1]
C60  10nF  [0603 Capacitor]
C61  10uF  [GCM21BR71H105KA03L-Footprint-1]
C62  1uF  [GCM21BR71H105KA03L-Footprint-1]
C63  10nF  [0603 Capacitor]
C64  10uF  [GCM21BR71H105KA03L-Footprint-1]
C65  1uF  [GCM21BR71H105KA03L-Footprint-1]
C66  10nF  [0603 Capacitor]
C67  10uF  [GCM21BR71H105KA03L-Footprint-1]
C68  1uF  [GCM21BR71H105KA03L-Footprint-1]
C69  10nF  [0603 Capacitor]
D12  BAS-21  [NEXPERIA_SOT23]
P11  B2B-XH-A(LF)(SN)  [XH 2 PIN VERT]
R33  2K  [0603]
R34  1k  [0603]
R37  10K (Var)  [B 3296]
R39  1.2k  [0603]
R40  1.2k  [0603]
U11  ADuM210N  [SOIC-8W]
U13  ISOW7741QDFMRQ1  [TI-SOIC-20]
U14  TLA2518IRTER  [QFN50P300X300X80_HS-17N]
U19  TLV7031-Q1  [TI SOT-23-5]

### Ports
dIP_PDOC_OK (see TopLevel[3C], Microcontroller[4D], Safety Loop[1C]), dIP_SPI_MISO (see TopLevel[3C], HV Sense[4B], Microcontroller[4C]), dOP_SPI_CLK (see TopLevel[3C], HV Sense[4B], Microcontroller[4C]), dOP_SPI_CS_PDOC (see TopLevel[3C], Microcontroller[2D]), dOP_SPI_MOSI (see TopLevel[3C], HV Sense[4B], Microcontroller[4C])

### Nets
0V_(ISO): C35.1 C61.1 C62.1 C63.1 C64.1 C65.1 C66.1 U11.5(GND2) U11.7(GND2) U13.6(GNDIO) U13.10(GND1)
3V3: C35.2 C61.2 C62.2 C63.2 C64.2 C65.2 C66.2 R40.1 U11.8(VDD2) U13.1(VIO) U13.7(EN_IO1) U13.9(VDD)
GND_PDOC: C36.1 C37.1 C38.1 C39.1 C44.1 C45.1 C46.1 C58.1 C59.1 C60.1 C67.1 C68.1 C69.1 P11.1 R37.3(CW) U11.4(GND1) U13.11(GND2) U13.15(GISOIN) U14.9(GND) U19.2(V-)
VDD_PDOC: C37.2 C38.2 C45.2 C46.2 C58.2 C59.2 C60.2 C67.2 C68.2 C69.2 R33.2 R37.1(CCW) R39.2 U11.1(VDD1) U11.3(VDD1) U13.12(VISOOUT) U13.13(VSEL) U13.14(EN_IO2) U13.20(VISOIN) U14.7(AVDD) U14.10(DVDD) U19.5(Vcc)
CLK_ADC: U13.18(OUTB) U14.13(SCLCK)
CS_ADC: R39.1 U13.19(OUTA) U14.11(CS)
MISO_ADC: U13.16(IND) U14.12(SDO)
MOSI_ADC: U13.17(OUTC) U14.14(SDI)
NetC36_2: C36.2 P11.2 R33.1 U14.4(GPIO5) U19.3(IN+)
NetC39_2: C39.2 R37.2(Wiper) U14.5(GPIO6) U19.4(IN-)
NetC44_2: C44.2 U14.8(DECAP)
NetD12_A: D12.A U13.5(OUTD)
NetD12_K: D12.K ; port dIP_SPI_MISO
NetR23_1: U13.2(INA) ; port dOP_SPI_CS_PDOC
NetR34_1: R34.1 U19.1(OUT)
NetR34_2: R34.2 U11.2(DIN)
NetR40_2: R40.2 U13.8(EN/FLT)
NetU8_26: U11.6(DOUT) ; port dIP_PDOC_OK
NetU8_27: U13.3(INB) ; port dOP_SPI_CLK
NetU8_29: U13.4(INC) ; port dOP_SPI_MOSI

Not connected (* = marked no-connect by the designer): U14 1(GPIO2) 2(GPIO3) 3(GPIO4) 6(GPIO7) 15(GPIO0) 16(GPIO1)

### Notes on the sheet
- https://www.cantherm.com/wp-content/uploads/2017/05/CWF_11x17_OCT_2014_1.pdf
- HIGH VOLTAGE
- ISOLATED
- The PDOC (Precharge/Discharge Overcurrent) is intended to limit the failure of the precharge resistor by monitoring its temperature in in the case of a failure of a resistor will break the safety loop.
- (in symbol CMP-102-000028-7) 0603
- (in symbol CMP-102-000033-3) 0805
- (in symbol CMP-102-000034-2) 0805
- (in symbol GCM21BR71H105KA03L) 0805
- (in symbol GCM188L81H104KA57D) 0603
- (in symbol RC0603FR-071KL) 0603
- (in symbol RC0603FR-072KL) 0603
- (in symbol RC0603JR-071K2L) 0603
- (in symbol GRM21BR6YA106KE43L) 0805

### Library data of the parts
C35-C39 C45 C46 = GCM188L81H104KA57D: as C7 on sheet Power Supply; Part Number: GCM188L81H104KA57D; Value: 100nF; Digikey Part Number: 490-6049-1-ND
C44 = GCM21BR71H105KA03L: Manufacturer: muRata; Rated Voltage: 50V; Tolerance: ±10%; Material: MLCC; Temperature Rating: X7R; Part Number: GCM21BR71H105KA03L; Value: 1µF; Digikey Part Number: 490-10675-1-ND
C58 C61 C64 C67 = CMP-102-000034-2: Ceramic Capacitor, Multilayer, Ceramic, 35V, 10% +Tol, 10% -Tol, X5R, 15% TC, 10uF, Surface Mount, 0805; Part Number: GRM21BR6YA106KE43L; Value: 10µF; Material: X7R; Tolerance: 10%; Rated Voltage: 35V; Digikey Link: https://www.digikey.com.au/en/products/detail/murata-electronics/GRM21BR6YA106KE43L/5027598?s=N4IgTCBcDaIOICUCyYCMAhBA2AmgQVQAYsBpAUQBYBmAGQAIQBdAXyA
C59 C62 C65 C68 = CMP-102-000033-3: Ceramic Capacitor, Multilayer, Ceramic, 50V, 10% +Tol, 10% -Tol, X7R, 15% TC, 1uF, Surface Mount, 0805; Part Number: GCM21BR71H105KA03L; Value: 1µF; Rated Voltage: 50V; Digikey Link: https://www.digikey.com.au/en/products/detail/murata-electronics/GCM21BR71H105KA03L/4903984?s=N4IgTCBcDaIOIGECyYCMAhASgdlQCVQAYBWAaQEFCBmAGRAF0BfIA; Tolerance: 10%; Material: X7R
C60 C63 C66 C69 = CMP-102-000028-7: Ceramic Capacitor, Multilayer, Ceramic, 50V, 5% +Tol, 5% -Tol, C0G, 30ppm/Cel TC, 0.01uF, Surface Mount, 0603; Part Number: GCM1885C1H103JA16D; Value: 10nF; Material: C0G; Rated Voltage: 50V; Tolerance: 5%; Digikey Link: https://www.digikey.com.au/en/products/detail/murata-electronics/GCM1885C1H103JA16D/13401923?s=N4IgTCBcDaIOIGECyBGAHGgrAlAJFADAMwBSAgigGwAiIAugL5A
D12 = BAS-21: Manufacturer: Nexperia USA Inc.; Forward Voltage: 1.0V; Breakdown Voltage: 250V; Rated Power: 250mW; Part Number: BAS-21
P11 = B2B-XH-A(LF)(SN): Positions: 2; Pitch: 2.54mm; Angle: 0; Flange: No; Contact: Tin; Part Number: B2B-XH-A(LF)(SN); Row Spacing: 2.54mm; Digikey Part Number: 455-2247-ND; Digikey Link: https://www.digikey.com.au/en/products/detail/jst-sales-america-inc/B2B-XH-A-LF-SN/1651045
R33 = RC0603FR-072KL: as R5 on sheet Power Supply; Part Number: RC0603FR-072KL; Value: 2K; Digikey Part Number: 311-2.00KHRCT-ND; Material: FR-07
R34 = RC0603FR-071KL: as R7 on sheet Power Supply; Part Number: RC0603FR-071KL; Value: 1k; Digikey Part Number: 311-1.00KHRCT-ND; Material: FR-07
R37 = 3296W-1-103LF: Manufacturer: Bournes Inc; Tolerance: 0.1; Rated Power: 0.5W; Part Number: 3296W-1-103LF; Value: 10K (Var); Digikey Part Number: 3296W-103LF-ND
R39 R40 = RC0603JR-071K2L: Manufacturer: YAGEO; Tolerance: 0.01; Rated Power: 0.1W; Part Number: RC0603JR-071K2L; Value: 1.2k; Material: FR-07; Digikey Part Number: 311-1.2KGRCT-ND
U11 = CMP-110-000007-1: DIGITAL ISOLATOR, SINGLE CHANNEL; Digikey Link: #https://www.analog.com/media/en/technical-documentation/data-sheets/ADuM210N.pdf#; Part Number: ADuM210N
U13 = CMP-001-0030-1: Automotive, low-emissions, quad-channel 3/1 reinforced digital isolator with integrated power 20-SOIC -40 to 125
U14 = CMP-001-0002-15: 8-Channel Single ADC SAR 1Msps 12-bit Serial 16-Pin WQFN EP T/R; Digikey Link: https://www.digikey.com.au/en/products/detail/texas-instruments/ADS7028IRTER/12696020?s=N4IgTCBcDaIIIBEDKB2ADGAHASQEoBUBRXEAXQF8g
U19 = TLV7031-Q1: Manufacturer: Texas Instruments; Input Voltage: 1.6 to 6.5 V; Channels: 1; Output: Push-Pull; Part Number: TLV7031-Q1; Digikey Part Number: 296-TLV7031QDBVRQ1CT-ND

## Sheet HV Sense.SchDoc
size A4; SheetNumber: 7; SheetTotal: 11
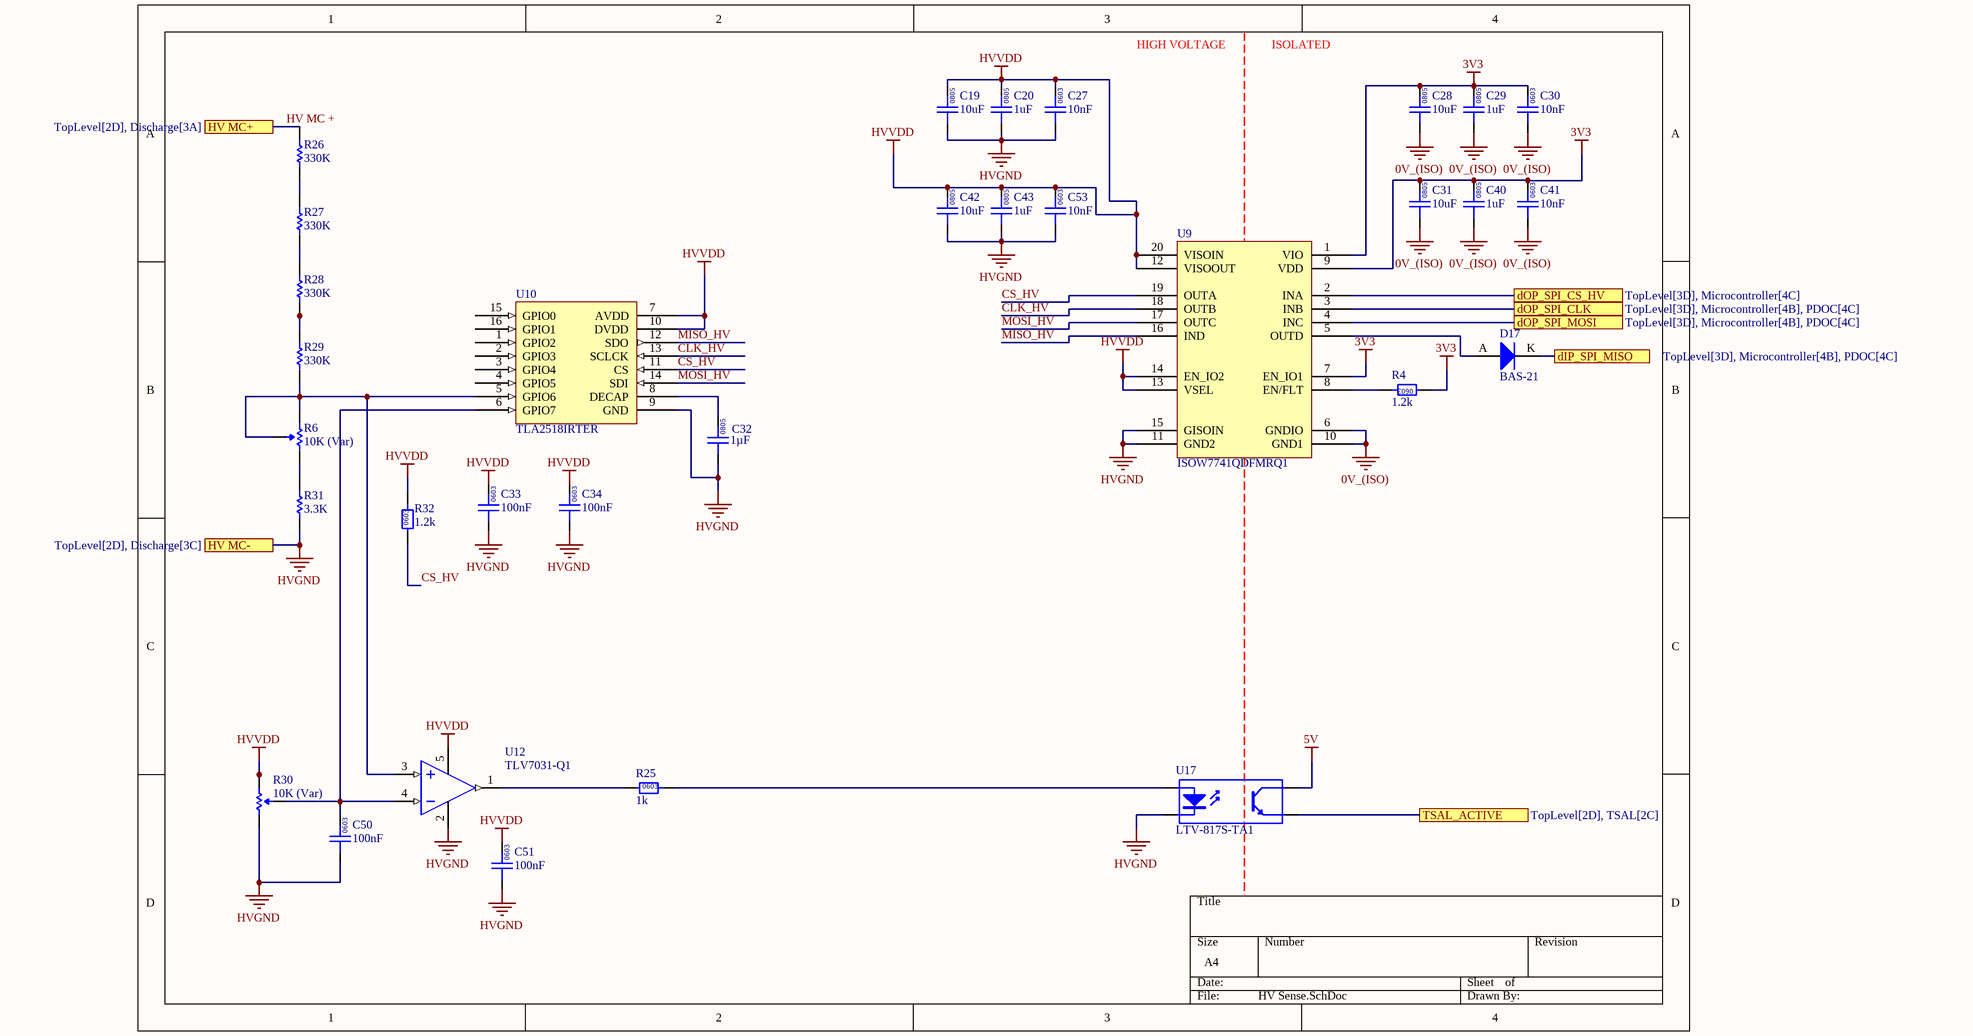
[diagram p6: HV Sense.SchDoc]

### Parts
C19  10uF  [GCM21BR71H105KA03L-Footprint-1]
C20  1uF  [GCM21BR71H105KA03L-Footprint-1]
C27  10nF  [0603 Capacitor]
C28  10uF  [GCM21BR71H105KA03L-Footprint-1]
C29  1uF  [GCM21BR71H105KA03L-Footprint-1]
C30  10nF  [0603 Capacitor]
C31  10uF  [GCM21BR71H105KA03L-Footprint-1]
C32  1µF  [0805]
C33  100nF  [0603]
C34  100nF  [0603]
C40  1uF  [GCM21BR71H105KA03L-Footprint-1]
C41  10nF  [0603 Capacitor]
C42  10uF  [GCM21BR71H105KA03L-Footprint-1]
C43  1uF  [GCM21BR71H105KA03L-Footprint-1]
C50  100nF  [0603]
C51  100nF  [0603]
C53  10nF  [0603 Capacitor]
D17  BAS-21  [NEXPERIA_SOT23]
R4  1.2k  [0603]
R6  10K (Var)  [B 3296]
R25  1k  [0603]
R26  330K  [VB 0207]
R27  330K  [VB 0207]
R28  330K  [VB 0207]
R29  330K  [VB 0207]
R30  10K (Var)  [B 3296]
R31  3.3K  [VB 0207]
R32  1.2k  [0603]
U9  ISOW7741QDFMRQ1  [TI-SOIC-20]
U10  TLA2518IRTER  [QFN50P300X300X80_HS-17N]
U12  TLV7031-Q1  [TI SOT-23-5]
U17  LTV-817S-TA1  [ON 4-SMD]

### Ports
dIP_SPI_MISO (see TopLevel[3D], Microcontroller[4B], PDOC[4C]), dOP_SPI_CLK (see TopLevel[3D], Microcontroller[4B], PDOC[4C]), dOP_SPI_CS_HV (see TopLevel[3D], Microcontroller[4C]), dOP_SPI_MOSI (see TopLevel[3D], Microcontroller[4B], PDOC[4C]), HV MC+ (see TopLevel[2D], Discharge[3A]), HV MC- (see TopLevel[2D], Discharge[3C]), TSAL_ACTIVE (see TopLevel[2D], TSAL[2C])

### Nets
0V_(ISO): C28.1 C29.1 C30.1 C31.1 C40.1 C41.1 U9.6(GNDIO) U9.10(GND1)
3V3: C28.2 C29.2 C30.2 C31.2 C40.2 C41.2 R4.1 U9.1(VIO) U9.7(EN_IO1) U9.9(VDD)
5V: U17.4(C)
HVGND: C19.1 C20.1 C27.1 C32.1 C33.1 C34.1 C42.1 C43.1 C50.1 C51.1 C53.1 R30.3(CW) R31.1 U9.11(GND2) U9.15(GISOIN) U10.9(GND) U12.2(V-) U17.2(K) ; port HV MC-  [project net HV MC-]
HVVDD: C19.2 C20.2 C27.2 C33.2 C34.2 C42.2 C43.2 C51.2 C53.2 R30.1(CCW) R32.2 U9.12(VISOOUT) U9.13(VSEL) U9.14(EN_IO2) U9.20(VISOIN) U10.7(AVDD) U10.10(DVDD) U12.5(Vcc)
CLK_HV: U9.18(OUTB) U10.13(SCLCK)
CS_HV: R32.1 U9.19(OUTA) U10.11(CS)
HV MC +: R26.2 ; port HV MC+
MISO_HV: U9.16(IND) U10.12(SDO)
MOSI_HV: U9.17(OUTC) U10.14(SDI)
TSAL_ACTIVE: U17.3(E) ; port TSAL_ACTIVE
NetC32_2: C32.2 U10.8(DECAP)
NetC50_2: C50.2 R30.2(Wiper) U10.6(GPIO7) U12.4(IN-)
NetD12_K: D17.K ; port dIP_SPI_MISO
NetD17_A: D17.A U9.5(OUTD)
NetR4_2: R4.2 U9.8(EN/FLT)
NetR6_1: R6.1(CCW) R31.2
NetR6_2: R6.2(Wiper) R6.3(CW) R29.1 U10.5(GPIO6) U12.3(IN+)
NetR22_1: U9.2(INA) ; port dOP_SPI_CS_HV
NetR25_1: R25.1 U12.1(OUT)
NetR25_2: R25.2 U17.1(A)
NetR26_1: R26.1 R27.2
NetR27_1: R27.1 R28.2
NetR28_1: R28.1 R29.2
NetU8_27: U9.3(INB) ; port dOP_SPI_CLK
NetU8_29: U9.4(INC) ; port dOP_SPI_MOSI

Not connected (* = marked no-connect by the designer): U10 1(GPIO2) 2(GPIO3) 3(GPIO4) 4(GPIO5) 15(GPIO0) 16(GPIO1)

### Notes on the sheet
- HIGH VOLTAGE
- ISOLATED
- (in symbol CMP-102-000028-7) 0603
- (in symbol CMP-102-000033-3) 0805
- (in symbol CMP-102-000034-2) 0805
- (in symbol GCM21BR71H105KA03L) 0805
- (in symbol GCM188L81H104KA57D) 0603
- (in symbol RC0603FR-071KL) 0603
- (in symbol RC0603JR-071K2L) 0603
- (in symbol GRM21BR6YA106KE43L) 0805

### Library data of the parts
C19 C28 C31 C42 = CMP-102-000034-2: as C58 on sheet PDOC; Tolerance: 10%; Rated Voltage: 35V; Digikey Link: https://www.digikey.com.au/en/products/detail/murata-electronics/GRM21BR6YA106KE43L/5027598?s=N4IgTCBcDaIOICUCyYCMAhBA2AmgQVQAYsBpAUQBYBmAGQAIQBdAXyA
C20 C29 C40 C43 = CMP-102-000033-3: as C59 on sheet PDOC; Rated Voltage: 50V; Digikey Link: https://www.digikey.com.au/en/products/detail/murata-electronics/GCM21BR71H105KA03L/4903984?s=N4IgTCBcDaIOIGECyYCMAhASgdlQCVQAYBWAaQEFCBmAGRAF0BfIA; Tolerance: 10%; Material: X7R
C27 C30 C41 C53 = CMP-102-000028-7: as C60 on sheet PDOC; Value: 10nF; Material: C0G; Rated Voltage: 50V; Tolerance: 5%; Digikey Link: https://www.digikey.com.au/en/products/detail/murata-electronics/GCM1885C1H103JA16D/13401923?s=N4IgTCBcDaIOIGECyBGAHGgrAlAJFADAMwBSAgigGwAiIAugL5A
C32 = GCM21BR71H105KA03L: as C44 on sheet PDOC; Part Number: GCM21BR71H105KA03L; Value: 1µF; Digikey Part Number: 490-10675-1-ND
C33 C34 C50 C51 = GCM188L81H104KA57D: as C7 on sheet Power Supply; Part Number: GCM188L81H104KA57D; Value: 100nF; Digikey Part Number: 490-6049-1-ND
D17 = BAS-21: as D12 on sheet PDOC; Part Number: BAS-21
R4 R32 = RC0603JR-071K2L: as R39 on sheet PDOC; Part Number: RC0603JR-071K2L; Value: 1.2k; Material: FR-07; Digikey Part Number: 311-1.2KGRCT-ND
R6 R30 = 3296W-1-103LF: as R37 on sheet PDOC; Part Number: 3296W-1-103LF; Value: 10K (Var); Digikey Part Number: 3296W-103LF-ND
R25 = RC0603FR-071KL: as R7 on sheet Power Supply; Part Number: RC0603FR-071KL; Value: 1k; Digikey Part Number: 311-1.00KHRCT-ND; Material: FR-07
R26-R29 = MMB02070C3303FB200: Manufacturer: Vishay Beyschlag; Tolerance: 0.01; Rated Power: 1W; Part Number: MMB02070C3303FB200; Value: 330K; Digikey Part Number: MMB-330KBCT-ND
R31 = MMB02070C3301FB200: Manufacturer: Vishay Beyschlag; Tolerance: 0.01; Rated Voltage: 1W; Part Number: MMB02070C3301FB200; Value: 3.3K; Digikey Part Number: MMB-3.30KBCT-ND
U9 = CMP-001-0030-1: as U13 on sheet PDOC
U10 = CMP-001-0002-15: as U14 on sheet PDOC; Digikey Link: https://www.digikey.com.au/en/products/detail/texas-instruments/ADS7028IRTER/12696020?s=N4IgTCBcDaIIIBEDKB2ADGAHASQEoBUBRXEAXQF8g
U12 = TLV7031-Q1: as U19 on sheet PDOC; Part Number: TLV7031-Q1; Digikey Part Number: 296-TLV7031QDBVRQ1CT-ND
U17 = LTV-817S-TA1: 35V 50ma Optocoupler (VF=1.2V); Manufacturer: Lite-On Inc; Part Number: LTV-817S-TA1; Digikey Part Number: 160-1893-2-ND; Digikey Link: https://www.digikey.com/product-detail/en/lite-on-inc/LTV-817S-TA1/160-1893-2-ND/388451

## Sheet Microcontroller.SchDoc
size A4; SheetNumber: 6; SheetTotal: 11
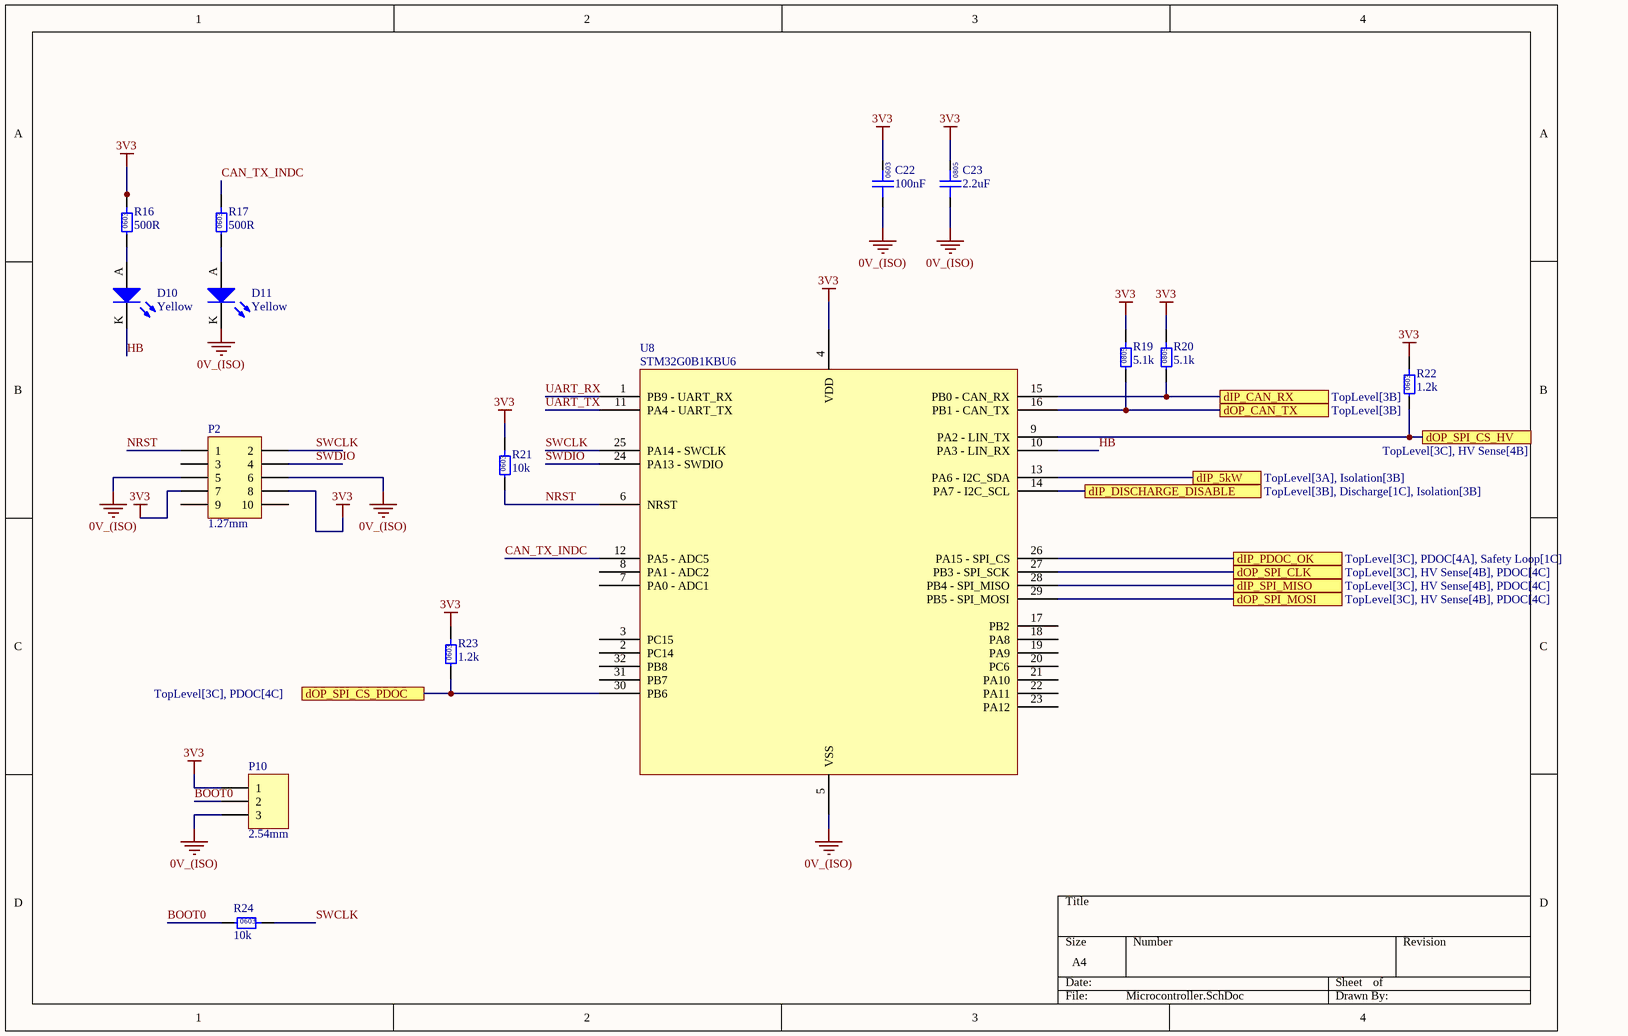
[diagram p7: Microcontroller.SchDoc]

### Parts
C22  100nF  [0603 Capacitor]
C23  2.2uF  [GCM21BR71H105KA03L-Footprint-1]
D10  Yellow  [0805 LED]
D11  Yellow  [0805 LED]
P2  1.27mm  [3221-10-0300-00]
P10  2.54mm  [TH 2.54mm Header 1x3]
R16  500R  [0603]
R17  500R  [0603]
R19  5.1k  [0805]
R20  5.1k  [0805]
R21  10k  [0603]
R22  1.2k  [0603]
R23  1.2k  [0603]
R24  10k  [0603]
U8  STM32G0B1KBU6  [ST-UFQFPN32]

### Ports
dIP_5kW (see TopLevel[3A], Isolation[3B]), dIP_CAN_RX (see TopLevel[3B]), dIP_DISCHARGE_DISABLE (see TopLevel[3B], Discharge[1C], Isolation[3B]), dIP_PDOC_OK (see TopLevel[3C], PDOC[4A], Safety Loop[1C]), dIP_SPI_MISO (see TopLevel[3C], HV Sense[4B], PDOC[4C]), dOP_CAN_TX (see TopLevel[3B]), dOP_SPI_CLK (see TopLevel[3C], HV Sense[4B], PDOC[4C]), dOP_SPI_CS_HV (see TopLevel[3C], HV Sense[4B]), dOP_SPI_CS_PDOC (see TopLevel[3C], PDOC[4C]), dOP_SPI_MOSI (see TopLevel[3C], HV Sense[4B], PDOC[4C])

### Nets
0V_(ISO): C22.1 C23.1 D11.K P2.5 P2.6 P10.3 U8.5(VSS)
3V3: C22.2 C23.2 P2.7 P2.8 P10.1 R16.2 R19.2 R20.2 R21.2 R22.2 R23.2 U8.4(VDD)
BOOT0: P10.2 R24.1
CAN_TX_INDC: R17.2 U8.12(PA5_-_ADC5)
HB: D10.K U8.10(PA3_-_LIN_RX)
NRST: P2.1 R21.1 U8.6(NRST)
SWCLK: P2.2 R24.2 U8.25(PA14_-_SWCLK)
SWDIO: P2.4 U8.24(PA13_-_SWDIO)
UART_RX: U8.1(PB9_-_UART_RX)
UART_TX: U8.11(PA4_-_UART_TX)
NetD10_A: D10.A R16.1
NetD11_A: D11.A R17.1
NetD12_K: U8.28(PB4_-_SPI_MISO) ; port dIP_SPI_MISO
NetR11_1: U8.14(PA7_-_I2C_SCL) ; port dIP_DISCHARGE_DISABLE
NetR19_1: R19.1 U8.16(PB1_-_CAN_TX) ; port dOP_CAN_TX
NetR20_1: R20.1 U8.15(PB0_-_CAN_RX) ; port dIP_CAN_RX
NetR22_1: R22.1 U8.9(PA2_-_LIN_TX) ; port dOP_SPI_CS_HV
NetR23_1: R23.1 U8.30(PB6) ; port dOP_SPI_CS_PDOC
NetU8_13: U8.13(PA6_-_I2C_SDA) ; port dIP_5kW
NetU8_26: U8.26(PA15_-_SPI_CS) ; port dIP_PDOC_OK
NetU8_27: U8.27(PB3_-_SPI_SCK) ; port dOP_SPI_CLK
NetU8_29: U8.29(PB5_-_SPI_MOSI) ; port dOP_SPI_MOSI

Not connected (* = marked no-connect by the designer): P2 3 9 10; U8 2(PC14) 3(PC15) 7(PA0_-_ADC1) 8(PA1_-_ADC2) 17(PB2) 18(PA8) 19(PA9) 20(PC6) 21(PA10) 22(PA11) 23(PA12) 31(PB7) 32(PB8)

### Notes on the sheet
- (in symbol CMP-102-000031-7) 0603
- (in symbol CMP-102-000032-2) 0805
- (in symbol RC0603FR-0710KL) 0603
- (in symbol RC0603JR-071K2L) 0603
- (in symbol RC0805FR075K1L) 0805
- (in symbol RT0603BRD07500RL) 0603
- (in symbol GCM21BR71H105KA03L) 0805
- (in symbol GCM188L81H104KA57D) 0603

### Library data of the parts
C22 = CMP-102-000031-7: Ceramic Capacitor, Multilayer, Ceramic, 50V, 10% +Tol, 10% -Tol, X8L, -40/+15% TC, 0.1uF, Surface Mount, 0603; Part Number: GCM188L81H104KA57D; Material: X8L; Digikey Link: https://www.digikey.com.au/en/products/detail/murata-electronics/GCM188L81H104KA57D/2591908?s=N4IgTCBcDaIOIGECyBGAHGgMmlAJFADACwDSAggKwDsAIiALoC%2BQA; Rated Voltage: 50V; Tolerance: 10%; Value: 100nF
C23 = CMP-102-000032-2: Ceramic Capacitor, Multilayer, Ceramic, 25V, 10% +Tol, 10% -Tol, X7R, 15% TC, 2.2uF, Surface Mount, 0805; Part Number: GRM21BR71E225KE11L; Rated Voltage: 50V; Value: 2.2µF; Material: X7R; Tolerance: 10%; Digikey Link: https://www.digikey.com.au/en/products/detail/murata-electronics/GRM21BR71E225KE11L/6606096?s=N4IgTCBcDaIOICUCyYCMAhBB2VBRMYArANK6qoAyIAugL5A
D10 D11 = SML-211YTT86: Yellow LED Indication - Discrete 1.75V 0805 (2012 Metric); Manufacturer: ROHM Semiconductor; Part Number: SML-211YTT86; Colour: Yellow; Digikey Part Number: 511-1293-1-ND
P2 = SMD 1.27mm Header 2x5 (3221-10-0300-00): Positions: 10; Angle: 0; Flange: No; Contact: NA; Part Number: SMD 1.27mm Header 2x5 (3221-10-0300-00); Pitch: 1.27mm; Row Spacing: 1.27mm
P10 = TH 2.54mm Header 1x3: Positions: 3; Angle: 0; Flange: No; Contact: NA; Part Number: TH 2.54mm Header 1x3; Pitch: 2.54mm; Row Spacing: 2.54mm
R16 R17 = RT0603BRD07500RL: Manufacturer: YAGEO; Tolerance: 0.01; Rated Power: 0.1W; Part Number: RT0603BRD07500RL; Value: 500R; Material: FR-07; Digikey Part Number: 13-RT0603BRD07500RL-ND
R19 R20 = RC0805FR075K1L: Manufacturer: YAGEO; Tolerance: 0.01; Rated Power: 0.125W; Part Number: RC0805FR075K1L; Value: 5.1k; Material: FR-07; Digikey Part Number: 311-5.10KCRCT-ND
R21 R24 = RC0603FR-0710KL: as R18 on sheet Safety Loop; Part Number: RC0603FR-0710KL; Value: 10k; Digikey Part Number: 311-10.0KHRCT-ND; Material: FR-07
R22 R23 = RC0603JR-071K2L: as R39 on sheet PDOC; Part Number: RC0603JR-071K2L; Value: 1.2k; Material: FR-07; Digikey Part Number: 311-1.2KGRCT-ND
U8 = CMP-029-000004-2: RISC Microcontroller, 32-Bit, FLASH, Cortex-M0+ CPU, 64MHz, CMOS

## Sheet 5kW Sensor.SchDoc
size A4; SheetNumber: 9; SheetTotal: 11
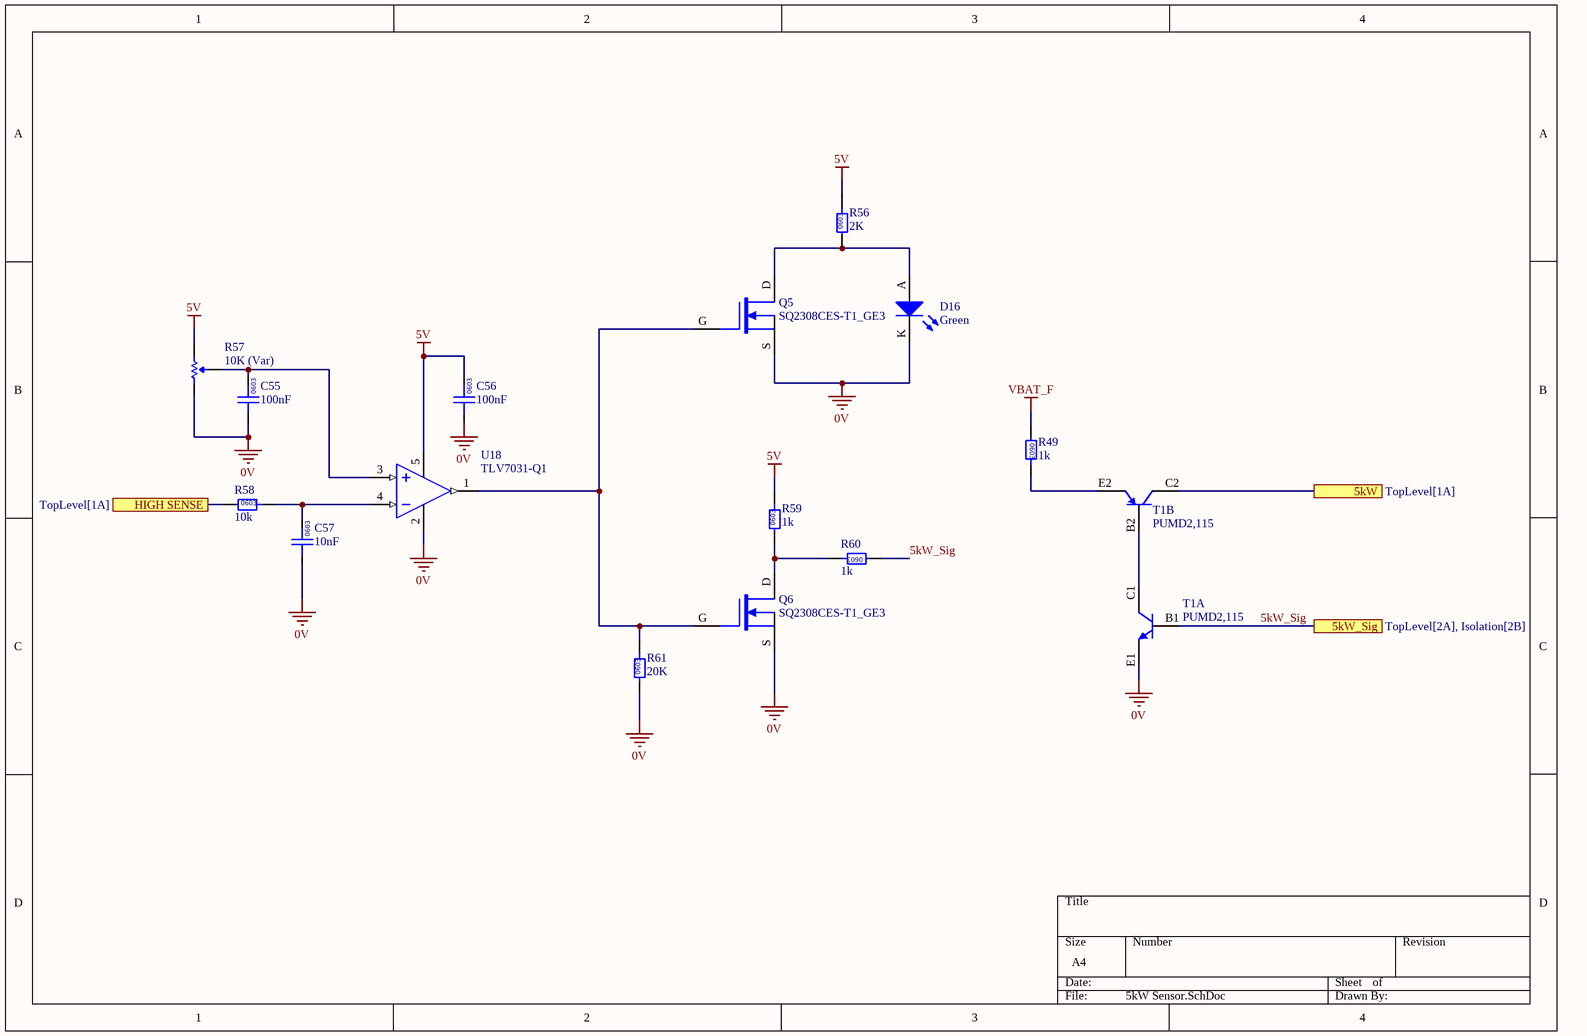
[diagram p8: 5kW Sensor.SchDoc]

### Parts
C55  100nF  [0603]
C56  100nF  [0603]
C57  10nF  [0603]
D16  Green  [0805 LED]
Q5  SQ2308CES-T1_GE3  [VSHY SOT-23-3]
Q6  SQ2308CES-T1_GE3  [VSHY SOT-23-3]
R49  1k  [0603]
R56  2K  [0603]
R57  10K (Var)  [B 3296]
R58  10k  [0603]
R59  1k  [0603]
R60  1k  [0603]
R61  20K  [0603]
T1  PUMD2,115  [NXP, SOT363]  (parts A,B of 2)
U18  TLV7031-Q1  [TI SOT-23-5]

### Ports
5kW (see TopLevel[1A]), 5kW_Sig (see TopLevel[2A], Isolation[2B]), HIGH SENSE (see TopLevel[1A])

### Nets
0V: C55.1 C56.1 C57.1 D16.K Q5.S Q6.S R57.3(CW) R61.1 T1.E1 U18.2(V-)
5V: C56.2 R56.2 R57.1(CCW) R59.2 U18.5(Vcc)
VBAT_F: R49.1
5kW: T1.C2(C) ; port 5kW
5kW_Sig: R60.1 T1.B1 ; port 5kW_Sig
HIGH_SENSE: R58.1 ; port HIGH SENSE
NetC55_2: C55.2 R57.2(Wiper) U18.3(IN+)
NetC57_2: C57.2 R58.2 U18.4(IN-)
NetD16_A: D16.A Q5.D R56.1
NetQ5_G: Q5.G Q6.G R61.2 U18.1(OUT)
NetQ6_D: Q6.D R59.1 R60.2
NetR49_2: R49.2 T1.E2(E)
NetT1_B2: T1.B2 T1.C1

### Notes on the sheet
- (in symbol GCM188L81H103KA03D) 0603
- (in symbol GCM188L81H104KA57D) 0603
- (in symbol RC0603FR-071KL) 0603
- (in symbol RC0603FR-072KL) 0603
- (in symbol RC0603FR-0710KL) 0603
- (in symbol RC0603FR-0720KL) 0603

### Library data of the parts
C55 C56 = GCM188L81H104KA57D: as C7 on sheet Power Supply; Part Number: GCM188L81H104KA57D; Value: 100nF; Digikey Part Number: 490-6049-1-ND
C57 = GCM188L81H103KA03D: Manufacturer: muRata; Rated Voltage: 50V; Tolerance: ±10%; Material: MLCC; Temperature Rating: X8L; Part Number: GCM188L81H103KA03D; Value: 10nF; Digikey Part Number: 490-GCM188L81H103KA03DCT-ND
D16 = SML-210FTT86: as D6 on sheet Safety Loop; Part Number: SML-210FTT86; Colour: Green; Digikey Part Number: 511-1285-1-ND
Q5 Q6 = SQ2308CES-T1_GE3: MOSFET N-CH 60V 2.3A SOT23; Manufacturer: Vishay Siliconix; Type: N-channel; Rated Power: 2W; Published: 24-Mar-1999; LatestRevisionDate: 29-May-2009; LatestRevisionNote: IPC-7351 Footprint Added.; PackageVersion: Sep-2000; PackageReference: SOT-343; Publisher: Altium Limited; PackageDescription: 4-Pin SOT-343 Package 1.3 mm Pitch, 2.1 mm Lead Span; Part Number: SQ2308CES-T1_GE3; Digikey Part Number: SQ2308CES-T1_GE3CT-ND
R49 R59 R60 = RC0603FR-071KL: as R7 on sheet Power Supply; Part Number: RC0603FR-071KL; Value: 1k; Material: FR-07; Digikey Part Number: 311-1.00KHRCT-ND
R56 = RC0603FR-072KL: as R5 on sheet Power Supply; Part Number: RC0603FR-072KL; Value: 2K; Material: FR-07; Digikey Part Number: 311-2.00KHRCT-ND
R57 = 3296W-1-103LF: as R37 on sheet PDOC; Part Number: 3296W-1-103LF; Value: 10K (Var); Digikey Part Number: 3296W-103LF-ND
R58 = RC0603FR-0710KL: as R18 on sheet Safety Loop; Part Number: RC0603FR-0710KL; Value: 10k; Material: FR-07; Digikey Part Number: 311-10.0KHRCT-ND
R61 = RC0603FR-0720KL: as R3 on sheet Power Supply; Part Number: RC0603FR-0720KL; Value: 20K; Material: FR-07; Digikey Part Number: 311-20.0KHRCT-ND
T1 = CMP-013-00000-1: Small Signal Bipolar Transistor, 0.1A I(C), 50V V(BR)CEO, 2-Element, NPN and PNP, Silicon; Transistor Application: SWITCHING; Number of Elements: 2; Reference Standard: IEC-60134; Polarity/Channel Type: NPN,PNP; Max Collector Current: 100mA; Package Body Material: Plastic; Time @ Peak Reflow Temperature-Max (s): 30s; DC Current Gain-Min (hFE): 60; Transistor Element Material: SILICON; Reach SVHC Compliant: Yes; JESD-30 Code: R-PDSO-G6; Peak Reflow Temperature (Cel): 260°C; JESD-609 Code: e3; RoHS Compliant: Yes; Package Shape: Rectangular; Surface Mount: Yes; Terminal Finish: Tin; Terminal Form: Gull Wing; Terminal Position: DUAL; Pins: 6; Moisture Sensitivity Level: 1; Collector-emitter Voltage-Max: 50V; Package Style: SMALL OUTLINEMeter
U18 = TLV7031-Q1: as U19 on sheet PDOC; Part Number: TLV7031-Q1; Digikey Part Number: 296-TLV7031QDBVRQ1CT-ND

## Sheet TSAL.SchDoc
size A3; SheetNumber: 11; SheetTotal: 11
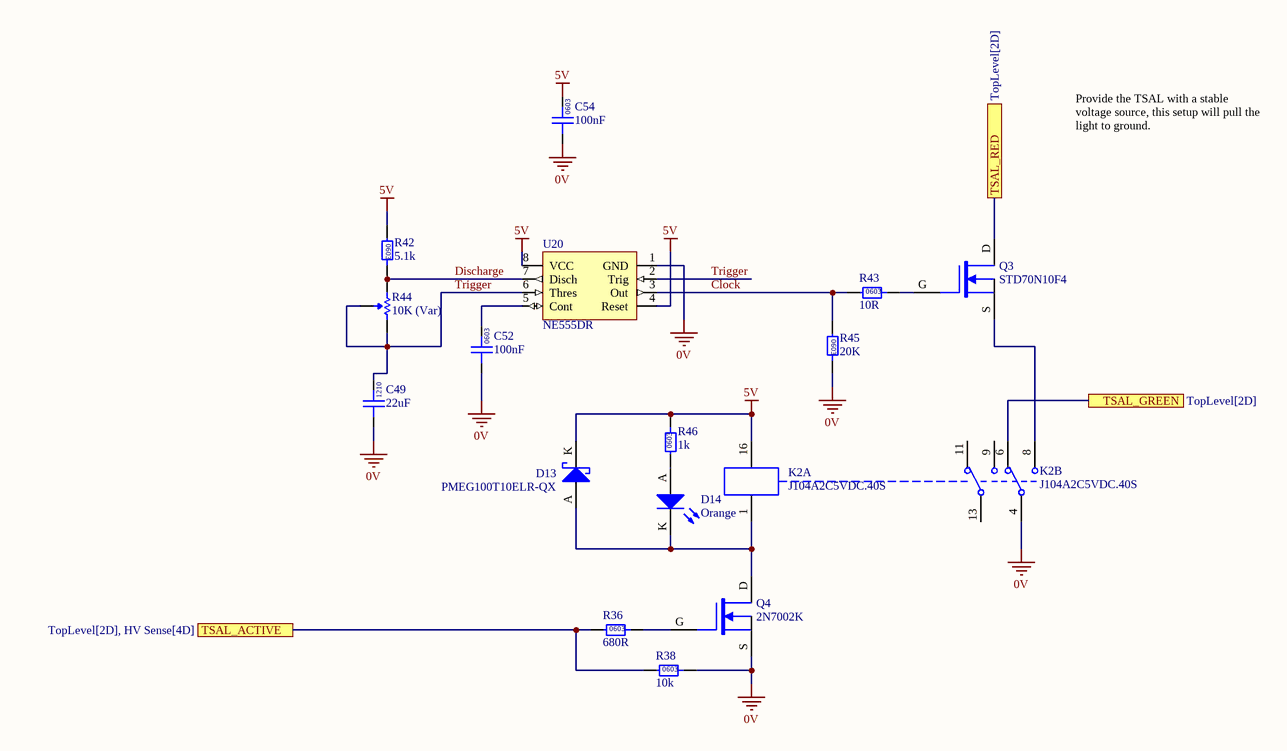
[diagram p9: TSAL.SchDoc]

### Parts
C49  22uF  [1210]
C52  100nF  [0603]
C54  100nF  [0603]
D13  PMEG100T10ELR-QX  [NXP SOD123W]
D14  Orange  [0805 LED]
K2  J104A2C5VDC.40S  [J104A2C5VDC.40S-Footprint-1]  (parts A,B of 2)
Q3  STD70N10F4  [STM TO-252 MOSFET]
Q4  2N7002K  [2N7002K-Footprint-1]
R36  680R  [0603]
R38  10k  [0603]
R42  5.1k  [0603]
R43  10R  [0603]
R44  10K (Var)  [B 3296]
R45  20K  [0603]
R46  1k  [0603]
U20  NE555DR  [TI 8-SOIC]

### Ports
TSAL_ACTIVE (see TopLevel[2D], HV Sense[4D]), TSAL_GREEN (see TopLevel[2D]), TSAL_RED (see TopLevel[2D])

### Nets
0V: C49.1 C52.1 C54.1 K2.4 Q4.S R38.2 R45.2 U20.1(GND)
5V: C54.2 D13.K K2.16 R42.1 R46.2 U20.4(Reset) U20.8(VCC)
Clock: R43.1 R45.1 U20.3(Out)
Discharge: R42.2 R44.3(CW) U20.7(Disch)
Trigger: C49.2 R44.1(CCW) R44.2(Wiper) U20.2(Trig) U20.6(Thres)
TSAL_ACTIVE: R36.1 R38.1 ; port TSAL_ACTIVE
TSAL_GREEN: K2.6 ; port TSAL_GREEN
TSAL_RED: Q3.D ; port TSAL_RED
NetC52_2: C52.2 U20.5(Cont)
NetD13_A: D13.A D14.K K2.1 Q4.D
NetD14_A: D14.A R46.1
NetK2_8: K2.8 Q3.S
NetQ3_G: Q3.G R43.2
NetQ4_G: Q4.G R36.2

Not connected (* = marked no-connect by the designer): K2 9 11 13

### Notes on the sheet
- Provide the TSAL with a stable voltage source, this setup will pull the light to ground.
- Section Leader Check:
- Date:
- Title:
- Revision
- Variant
- Project:
- Engineers:
- Sheet
- of
- (in symbol GCM188L81H104KA57D) 0603
- (in symbol GRM32ER71E226KE15L) 1210
- (in symbol RC0603FR-071KL) 0603
- (in symbol RC0603FR-0710KL) 0603
- (in symbol RC0603FR-0710RL) 0603
- (in symbol RC0603FR-0720KL) 0603
- (in symbol RC0603JR-075K1L) 0603
- (in symbol RC0603JR-13680RL) 0603

### Library data of the parts
C49 = GRM32ER71E226KE15L: as C17 on sheet Power Supply; Part Number: GRM32ER71E226KE15L; Value: 22uF; Digikey Part Number: 490-5313-2-ND
C52 C54 = GCM188L81H104KA57D: as C7 on sheet Power Supply; Part Number: GCM188L81H104KA57D; Value: 100nF; Digikey Part Number: 490-6049-1-ND
D13 = PMEG100T10ELR-QX: Manufacturer: Nexperia USA Inc.; Forward Voltage: 0.75 V @ 1A; Breakdown Voltage: 100 V; Rated Power: 680 mW; Part Number: PMEG100T10ELR-QX; Digikey Part Number: 1727-PMEG100T10ELR-QXCT-ND
D14 = SML-211DTT86: Orange LED Indication - Discrete 1.75V 0805 (2012 Metric); Manufacturer: ROHM Semiconductor; Part Number: SML-211DTT86; Colour: Orange; Digikey Part Number: 511-1291-1-ND
K2 = CMP-008-00001-1: Relay Gen Purpose DPDT 3A 5V
Q3 = STD70N10F4: N-Channel 100V 60A (Tc) 125W (Tc) Surface Mount DPAK; Manufacturer: STMicroelectronics; Published: 24-Mar-1999; LatestRevisionDate: 29-May-2009; LatestRevisionNote: IPC-7351 Footprint Added.; PackageVersion: Sep-2000; PackageReference: SOT-343; Publisher: Altium Limited; PackageDescription: 4-Pin SOT-343 Package 1.3 mm Pitch, 2.1 mm Lead Span; Part Number: STD70N10F4; Type: N-channel; Rated Power: 125W; Digikey Part Number: 497-8806-2-ND
Q4 = CMP-038-000000-2: 60V 380mA, NFET MOSTFET (Small Signal); Part Number: 2N7002K
R36 = RC0603JR-13680RL: Manufacturer: YAGEO; Tolerance: 0.01; Rated Power: 0.1W; Part Number: RC0603JR-13680RL; Value: 680R; Material: FR-07; Digikey Part Number: 13-RC0603JR-13680RLCT-ND
R38 = RC0603FR-0710KL: as R18 on sheet Safety Loop; Part Number: RC0603FR-0710KL; Value: 10k; Material: FR-07; Digikey Part Number: 311-10.0KHRCT-ND
R42 = RC0603JR-075K1L: Manufacturer: YAGEO; Tolerance: 0.01; Rated Power: 0.1W; Part Number: RC0603JR-075K1L; Value: 5.1k; Material: FR-07; Digikey Part Number: 311-5.1KGRCT-ND
R43 = RC0603FR-0710RL: Manufacturer: YAGEO; Tolerance: 0.01; Rated Power: 0.1W; Part Number: RC0603FR-0710RL; Value: 10R; Material: FR-07; Digikey Part Number: 311-10.0HRCT-ND
R44 = 3296W-1-103LF: as R37 on sheet PDOC; Part Number: 3296W-1-103LF; Value: 10K (Var); Digikey Part Number: 3296W-103LF-ND
R45 = RC0603FR-0720KL: as R3 on sheet Power Supply; Part Number: RC0603FR-0720KL; Value: 20K; Material: FR-07; Digikey Part Number: 311-20.0KHRCT-ND
R46 = RC0603FR-071KL: as R7 on sheet Power Supply; Part Number: RC0603FR-071KL; Value: 1k; Material: FR-07; Digikey Part Number: 311-1.00KHRCT-ND
U20 = CMP-022-000003-1: IC OSC SGL TIMER 100KHZ 8-SOIC; Part Number: NE555DR

## Nets that join several sheets
0V: TopLevel (P13.3), Power Supply (15 pins), Isolation (C47.1 D15.A R48.1 U15.4), Safety Loop (C25.1 Q1.S R18.2 U21.5), 5kW Sensor (10 pins), TSAL (8 pins)
0V_(ISO): Power Supply (C26.1 R7.1 U6.5), Isolation (C48.1 U15.5), Safety Loop (C24.1 U21.4), Discharge (Q2.S R35.2), PDOC (11 pins), HV Sense (8 pins), Microcontroller (7 pins)
3V3: Power Supply (C26.2 D5.A U6.7), Isolation (C48.2 U15.8), Safety Loop (C24.2 U21.1), Discharge (D8.A D9.K U7.2), PDOC (12 pins), HV Sense (10 pins), Microcontroller (12 pins)
5V: TopLevel (P13.2), Power Supply (6 pins), Isolation (C47.2 U15.1), Safety Loop (5 pins), HV Sense (U17.4), 5kW Sensor (5 pins), TSAL (7 pins)
5V_TSAL: TopLevel (U16.2), Power Supply (C17.2 U22.3)
GLV+: TopLevel (P1.12), Power Supply (F1.1)
GLV-: TopLevel (P1.1 P1.11), Power Supply (5 pins)
HV MC-: TopLevel (P6.1 P6.2 R2.2), Discharge (R15.2), HV Sense (18 pins)
VBAT_F: Power Supply (10 pins), 5kW Sensor (R49.1)
5kW: TopLevel (P1.8), 5kW Sensor (T1.C2)
5kW_Sig: Isolation (U15.2), 5kW Sensor (R60.1 T1.B1)
DISCHARGE_DISABLE: TopLevel (U16.1), Isolation (R41.1)
GL_IN: TopLevel (P1.10), Safety Loop (K1.9)
GL_INT: TopLevel (P12.1), Safety Loop (K1.13)
HIGH_SENSE: TopLevel (P13.1), 5kW Sensor (R58.1)
HV MC +: TopLevel (P5.1 P5.2 R1.2), Discharge (R10.1), HV Sense (R26.2)
NetD12_K: PDOC (D12.K), HV Sense (D17.K), Microcontroller (U8.28)
NetR11_1: Isolation (U15.6), Discharge (R11.1 R35.1), Microcontroller (U8.14)
NetR22_1: HV Sense (U9.2), Microcontroller (R22.1 U8.9)
NetR23_1: PDOC (U13.2), Microcontroller (R23.1 U8.30)
NetU8_13: Isolation (U15.7), Microcontroller (U8.13)
NetU8_26: Safety Loop (U21.2), PDOC (U11.6), Microcontroller (U8.26)
NetU8_27: PDOC (U13.3), HV Sense (U9.3), Microcontroller (U8.27)
NetU8_29: PDOC (U13.4), HV Sense (U9.4), Microcontroller (U8.29)
TSAL_ACTIVE: HV Sense (U17.3), TSAL (R36.1 R38.1)
TSAL_GREEN: TopLevel (U16.3), TSAL (K2.6)
TSAL_RED: TopLevel (U16.4), TSAL (Q3.D)